# Altium project RegistrationModule.PrjPCB (part 3 of 4)

## Sheet FPGA.SchDoc
size 685 x 375 mm; PageSetup: Record=PageOptions|CenterHorizontal=True|CenterVertical=True|PrintScale=0.85|XCorrection=1.00|YCorrection=1.00|PrintKind=2|BorderSize=5000000|LeftOffset=0|BottomOffset=0|Orientation=2|PaperLength=1000|PaperWidth=1000|Scale=100|PaperSource=7|PrintQuality=-4|MediaType=1|DitherType=10|PaperKind=A2|PrintScaleMode=1
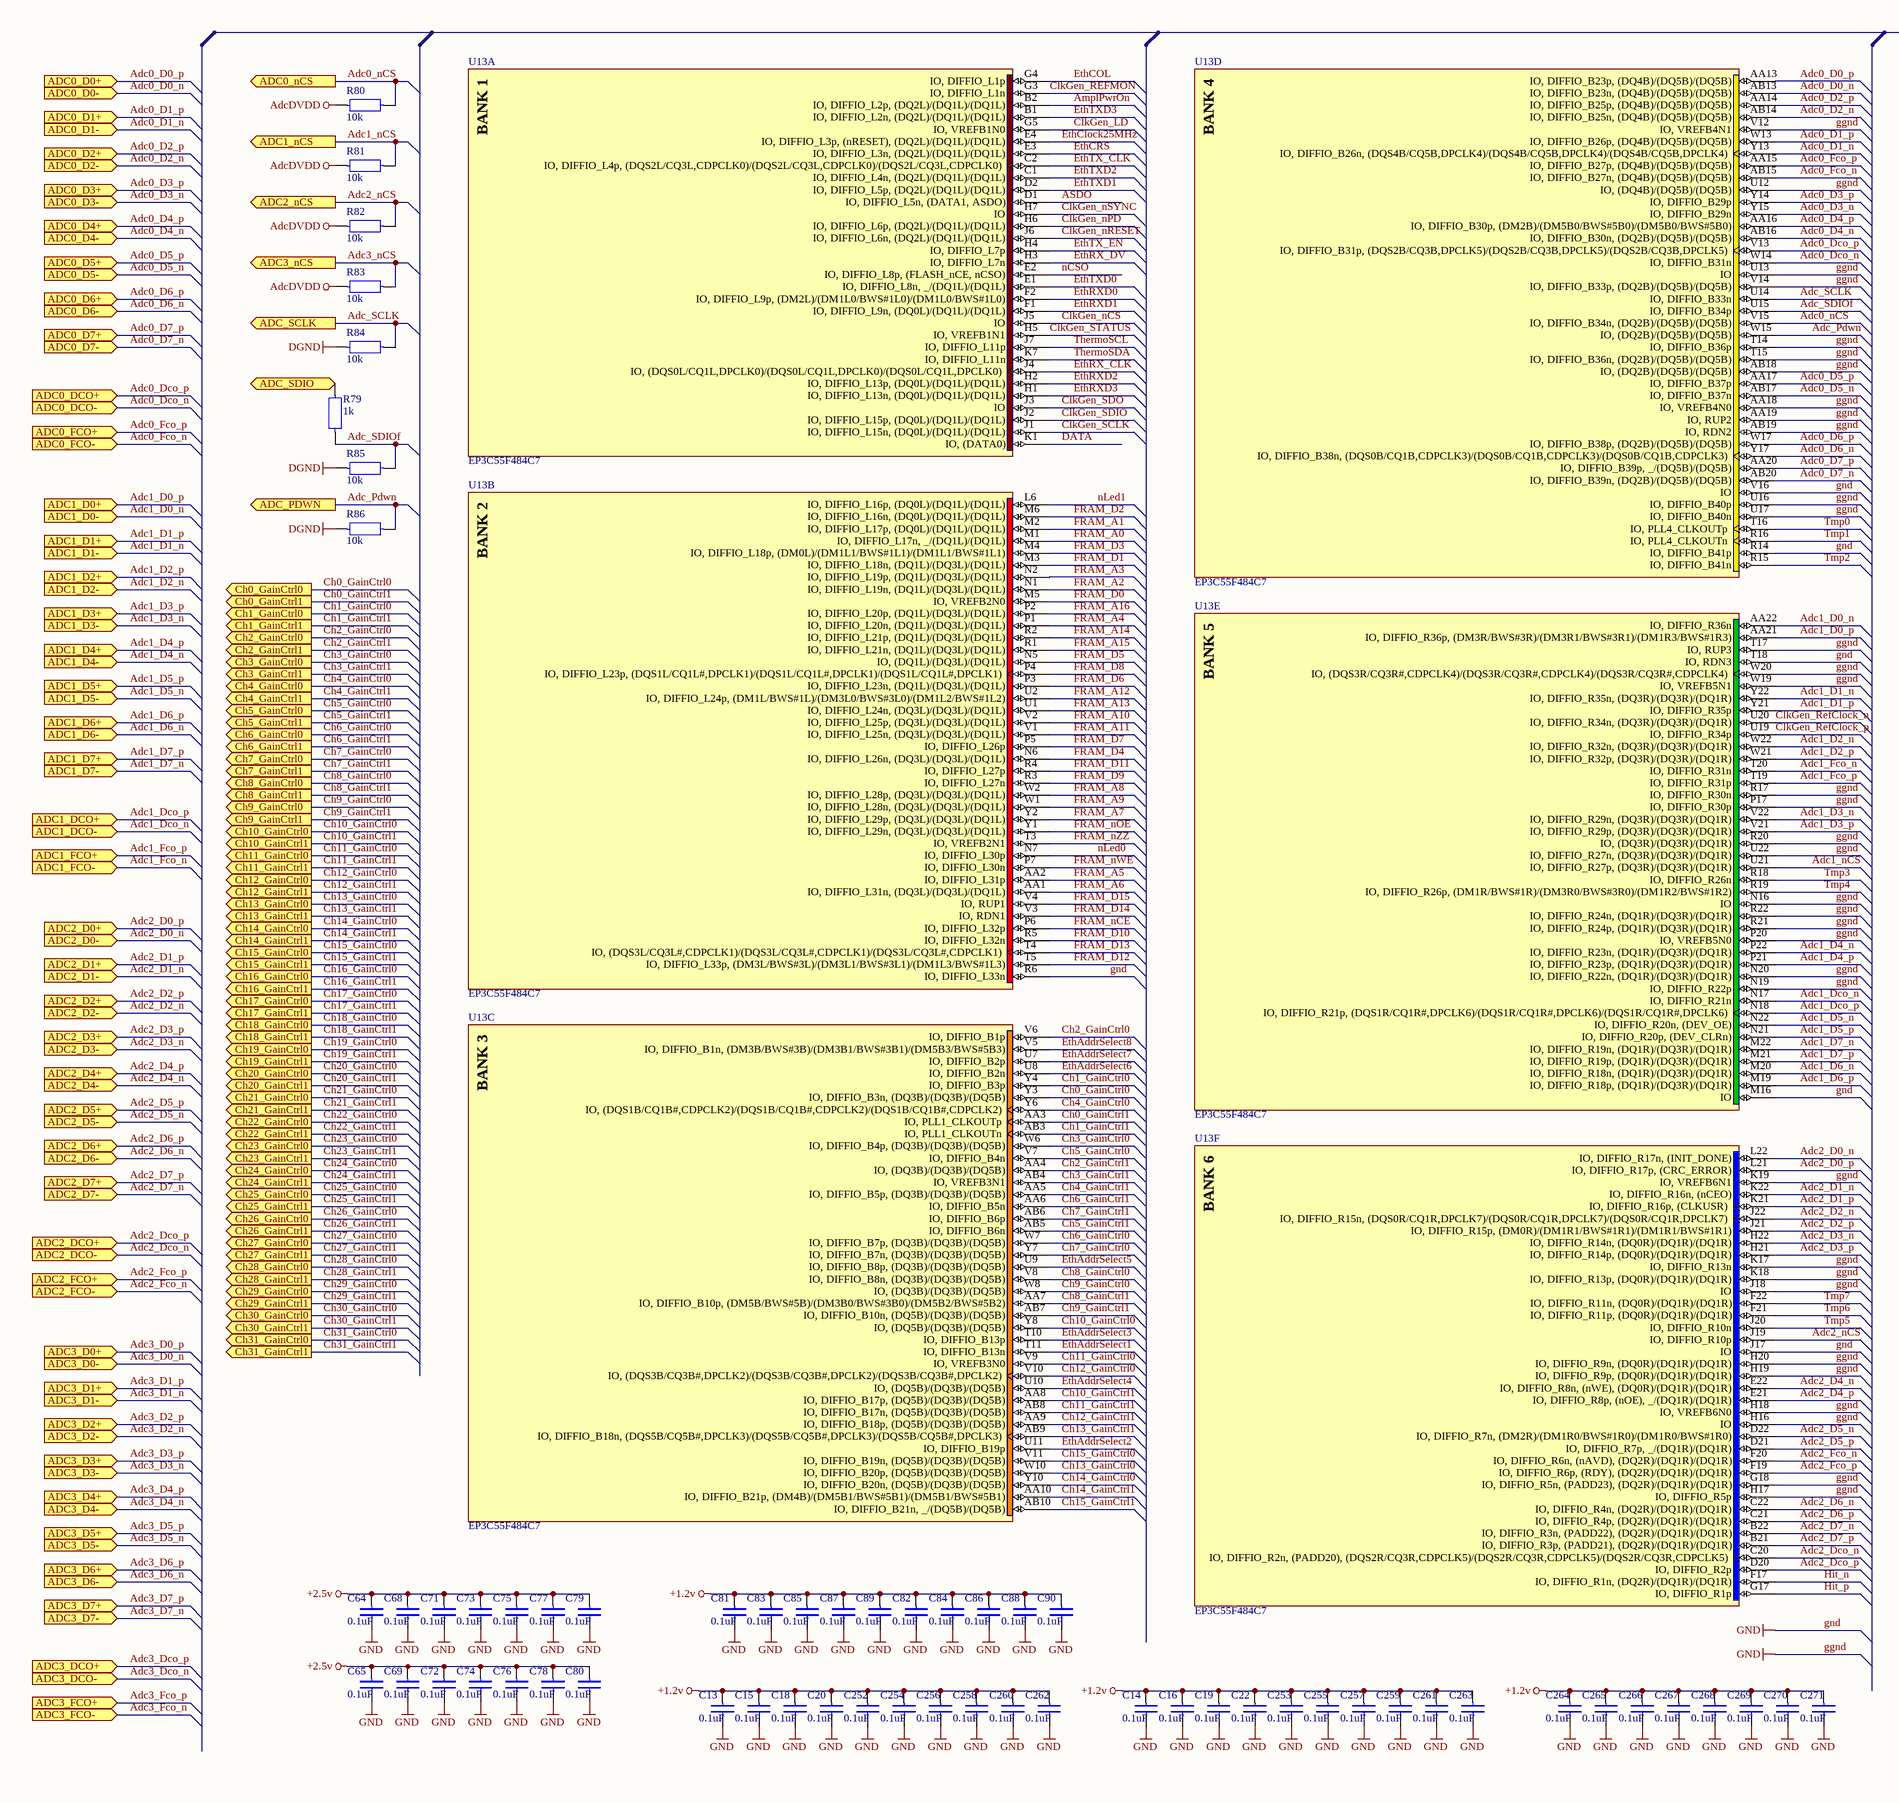
[diagram p7: FPGA.SchDoc, left]
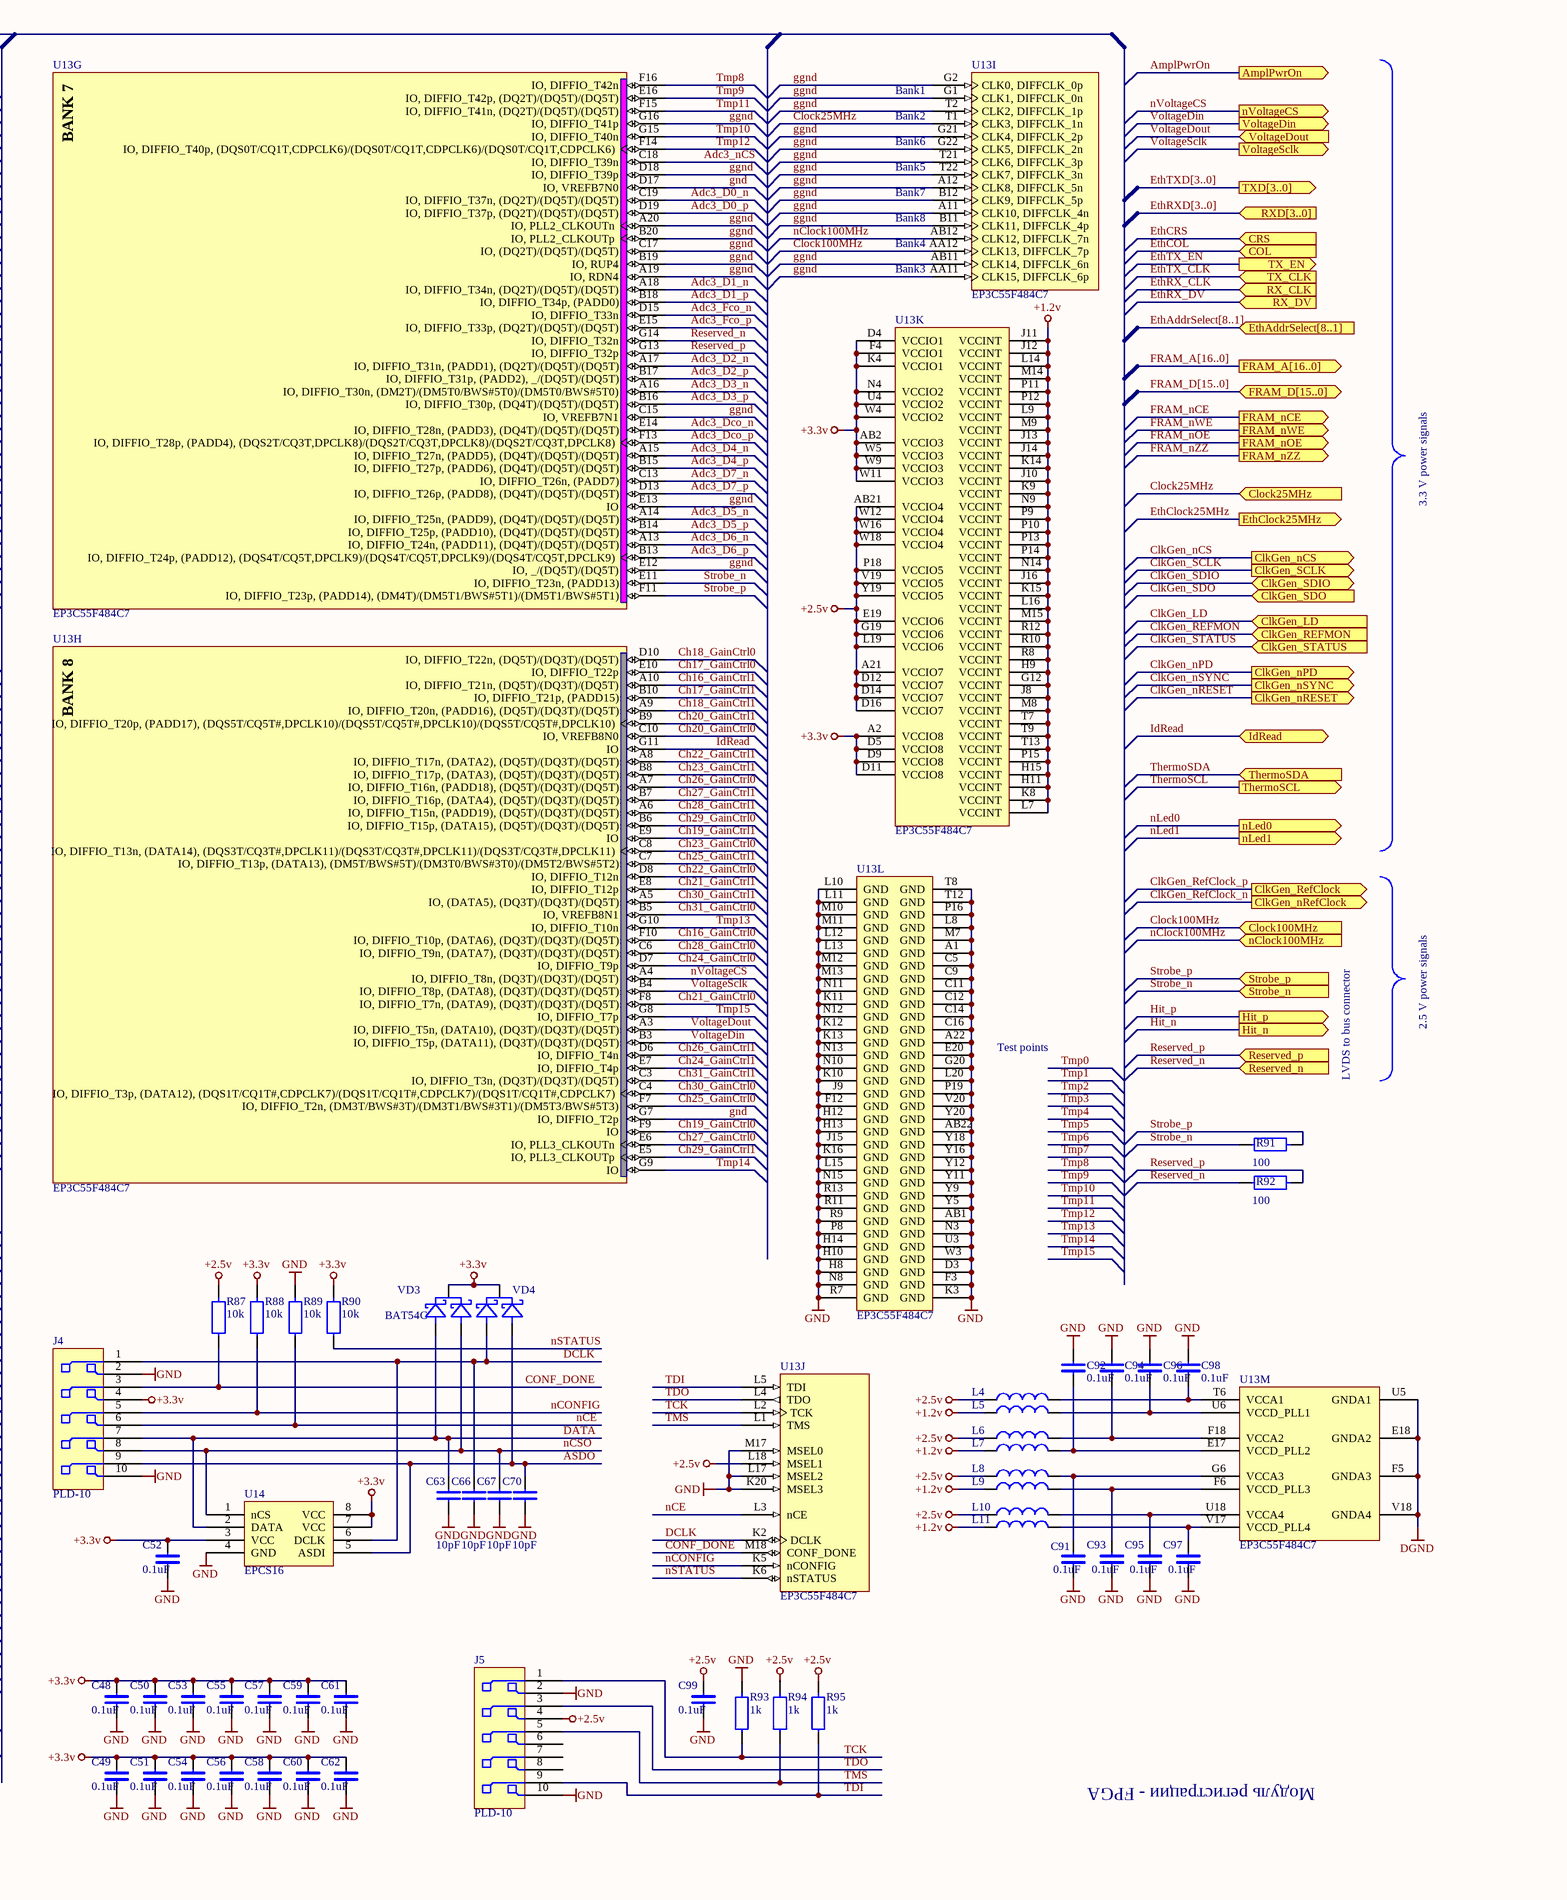
[diagram p8: FPGA.SchDoc, right]

### Parts
C13  0.1uF  [0402]
C14  0.1uF  [0402]
C15  0.1uF  [0402]
C16  0.1uF  [0402]
C18  0.1uF  [0402]
C19  0.1uF  [0402]
C20  0.1uF  [0402]
C22  0.1uF  [0402]
C48  0.1uF  [0402]
C49  0.1uF  [0402]
C50  0.1uF  [0402]
C51  0.1uF  [0402]
C52  0.1uF  [0603]
C53  0.1uF  [0402]
C54  0.1uF  [0402]
C55  0.1uF  [0402]
C56  0.1uF  [0402]
C57  0.1uF  [0402]
C58  0.1uF  [0402]
C59  0.1uF  [0402]
C60  0.1uF  [0402]
C61  0.1uF  [0402]
C62  0.1uF  [0402]
C63  10pF  [0603]
C64  0.1uF  [0402]
C65  0.1uF  [0402]
C66  10pF  [0603]
C67  10pF  [0603]
C68  0.1uF  [0402]
C69  0.1uF  [0402]
C70  10pF  [0603]
C71  0.1uF  [0402]
C72  0.1uF  [0402]
C73  0.1uF  [0402]
C74  0.1uF  [0402]
C75  0.1uF  [0402]
C76  0.1uF  [0402]
C77  0.1uF  [0402]
C78  0.1uF  [0402]
C79  0.1uF  [0402]
C80  0.1uF  [0402]
C81  0.1uF  [0402]
C82  0.1uF  [0402]
C83  0.1uF  [0402]
C84  0.1uF  [0402]
C85  0.1uF  [0402]
C86  0.1uF  [0402]
C87  0.1uF  [0402]
C88  0.1uF  [0402]
C89  0.1uF  [0402]
C90  0.1uF  [0402]
C91  0.1uF  [0402]
C92  0.1uF  [0402]
C93  0.1uF  [0402]
C94  0.1uF  [0402]
C95  0.1uF  [0402]
C96  0.1uF  [0402]
C97  0.1uF  [0402]
C98  0.1uF  [0402]
C99  0.1uF  [0603]
C252  0.1uF  [0402]
C253  0.1uF  [0402]
C254  0.1uF  [0402]
C255  0.1uF  [0402]
C256  0.1uF  [0402]
C257  0.1uF  [0402]
C258  0.1uF  [0402]
C259  0.1uF  [0402]
C260  0.1uF  [0402]
C261  0.1uF  [0402]
C262  0.1uF  [0402]
C263  0.1uF  [0402]
C264  0.1uF  [0402]
C265  0.1uF  [0402]
C266  0.1uF  [0402]
C267  0.1uF  [0402]
C268  0.1uF  [0402]
C269  0.1uF  [0402]
C270  0.1uF  [0402]
C271  0.1uF  [0402]
J4  PLD-10  [PLD10]
J5  PLD-10  [PLD10]
L4  EXC3BB221H  [0603]  (value not drawn)
L5  EXC3BB221H  [0603]  (value not drawn)
L6  EXC3BB221H  [0603]  (value not drawn)
L7  EXC3BB221H  [0603]  (value not drawn)
L8  EXC3BB221H  [0603]  (value not drawn)
L9  EXC3BB221H  [0603]  (value not drawn)
L10  EXC3BB221H  [0603]  (value not drawn)
L11  EXC3BB221H  [0603]  (value not drawn)
R79  1k  [0603]
R80  10k  [0603]
R81  10k  [0603]
R82  10k  [0603]
R83  10k  [0603]
R84  10k  [0603]
R85  10k  [0603]
R86  10k  [0603]
R87  10k  [0603]
R88  10k  [0603]
R89  10k  [0603]
R90  10k  [0603]
R91  100  [0402]
R92  100  [0402]
R93  1k  [0603]
R94  1k  [0603]
R95  1k  [0603]
U13  EP3C55F484C7  [FBGA484-3]  (parts A,B,C,D,E,F,G,H,I,J,K,L,M of 13)
U14  EPCS16  [8SOIC150]
VD3  BAT54C  [SOT-23]
VD4  BAT54C  [SOT-23]  (value not drawn)

### Ports
ADC0_D0+ (in), ADC0_D0- (in), ADC0_D1+ (in), ADC0_D1- (in), ADC0_D2+ (in), ADC0_D2- (in), ADC0_D3+ (in), ADC0_D3- (in), ADC0_D4+ (in), ADC0_D4- (in), ADC0_D5+ (in), ADC0_D5- (in), ADC0_D6+ (in), ADC0_D6- (in), ADC0_D7+ (in), ADC0_D7- (in), ADC0_DCO+ (in), ADC0_DCO- (in), ADC0_FCO+ (in), ADC0_FCO- (in), ADC0_nCS (out), ADC1_D0+ (in), ADC1_D0- (in), ADC1_D1+ (in), ADC1_D1- (in), ADC1_D2+ (in), ADC1_D2- (in), ADC1_D3+ (in), ADC1_D3- (in), ADC1_D4+ (in), ADC1_D4- (in), ADC1_D5+ (in), ADC1_D5- (in), ADC1_D6+ (in), ADC1_D6- (in), ADC1_D7+ (in), ADC1_D7- (in), ADC1_DCO+ (in), ADC1_DCO- (in), ADC1_FCO+ (in), ADC1_FCO- (in), ADC1_nCS (out), ADC2_D0+ (in), ADC2_D0- (in), ADC2_D1+ (in), ADC2_D1- (in), ADC2_D2+ (in), ADC2_D2- (in), ADC2_D3+ (in), ADC2_D3- (in), ADC2_D4+ (in), ADC2_D4- (in), ADC2_D5+ (in), ADC2_D5- (in), ADC2_D6+ (in), ADC2_D6- (in), ADC2_D7+ (in), ADC2_D7- (in), ADC2_DCO+ (in), ADC2_DCO- (in), ADC2_FCO+ (in), ADC2_FCO- (in), ADC2_nCS (out), ADC3_D0+ (in), ADC3_D0- (in), ADC3_D1+ (in), ADC3_D1- (in), ADC3_D2+ (in), ADC3_D2- (in), ADC3_D3+ (in), ADC3_D3- (in), ADC3_D4+ (in), ADC3_D4- (in), ADC3_D5+ (in), ADC3_D5- (in), ADC3_D6+ (in), ADC3_D6- (in), ADC3_D7+ (in), ADC3_D7- (in), ADC3_DCO+ (in), ADC3_DCO- (in), ADC3_FCO+ (in), ADC3_FCO- (in), ADC3_nCS (out), ADC_PDWN (out), ADC_SCLK (out), ADC_SDIO (bidir), AmplPwrOn (out), Ch0_GainCtrl0 (out), Ch0_GainCtrl1 (out), Ch1_GainCtrl0 (out), Ch1_GainCtrl1 (out), Ch2_GainCtrl0 (out), Ch2_GainCtrl1 (out), Ch3_GainCtrl0 (out), Ch3_GainCtrl1 (out), Ch4_GainCtrl0 (out), Ch4_GainCtrl1 (out), Ch5_GainCtrl0 (out), Ch5_GainCtrl1 (out), Ch6_GainCtrl0 (out), Ch6_GainCtrl1 (out), Ch7_GainCtrl0 (out), Ch7_GainCtrl1 (out), Ch8_GainCtrl0 (out), Ch8_GainCtrl1 (out), Ch9_GainCtrl0 (out), Ch9_GainCtrl1 (out), Ch10_GainCtrl0 (out), Ch10_GainCtrl1 (out), Ch11_GainCtrl0 (out), Ch11_GainCtrl1 (out), Ch12_GainCtrl0 (out), Ch12_GainCtrl1 (out), Ch13_GainCtrl0 (out), Ch13_GainCtrl1 (out), Ch14_GainCtrl0 (out), Ch14_GainCtrl1 (out), Ch15_GainCtrl0 (out), Ch15_GainCtrl1 (out), Ch16_GainCtrl0 (out), Ch16_GainCtrl1 (out), Ch17_GainCtrl0 (out), Ch17_GainCtrl1 (out), Ch18_GainCtrl0 (out), Ch18_GainCtrl1 (out), Ch19_GainCtrl0 (out), Ch19_GainCtrl1 (out), Ch20_GainCtrl0 (out), Ch20_GainCtrl1 (out), Ch21_GainCtrl0 (out), Ch21_GainCtrl1 (out), Ch22_GainCtrl0 (out), Ch22_GainCtrl1 (out), Ch23_GainCtrl0 (out), Ch23_GainCtrl1 (out), Ch24_GainCtrl0 (out), Ch24_GainCtrl1 (out), Ch25_GainCtrl0 (out), Ch25_GainCtrl1 (out), Ch26_GainCtrl0 (out), Ch26_GainCtrl1 (out), Ch27_GainCtrl0 (out), Ch27_GainCtrl1 (out), Ch28_GainCtrl0 (out), Ch28_GainCtrl1 (out), Ch29_GainCtrl0 (out), Ch29_GainCtrl1 (out), Ch30_GainCtrl0 (out), Ch30_GainCtrl1 (out), Ch31_GainCtrl0 (out), Ch31_GainCtrl1 (out), ClkGen_LD (in), ClkGen_nCS (out), ClkGen_nPD (out), ClkGen_nRefClock (out), ClkGen_nRESET (out), ClkGen_nSYNC (out), ClkGen_RefClock (out), ClkGen_REFMON (in), ClkGen_SCLK (out), ClkGen_SDIO (bidir), ClkGen_SDO (in), ClkGen_STATUS (in), Clock25MHz (in), Clock100MHz (in), COL (in), CRS (in), EthAddrSelect[8..1] (in), EthClock25MHz (out), FRAM_A[16..0] (out), FRAM_D[15..0] (bidir), FRAM_nCE (out), FRAM_nOE (out), FRAM_nWE (out), FRAM_nZZ (out), Hit_n (out), Hit_p (out), IdRead (bidir), nClock100MHz (in), nLed0 (out), nLed1 (out), nVoltageCS (out), Reserved_n (in), Reserved_p (in), RX_CLK (in), RX_DV (in), RXD[3..0] (in), Strobe_n (in), Strobe_p (in), ThermoSCL (out), ThermoSDA (in), TX_CLK (in), TX_EN (out), TXD[3..0] (out), VoltageDin (out), VoltageDout (in), VoltageSclk (out)

### Nets
+1.2v: C13.2 C14.2 C15.2 C16.2 C18.2 C19.2 C20.2 C22.2 C81.2 C82.2 C83.2 C84.2 C85.2 C86.2 C87.2 C88.2 C89.2 C90.2 C252.2 C253.2 C254.2 C255.2 C256.2 C257.2 C258.2 C259.2 C260.2 C261.2 C262.2 C263.2 C264.2 C265.2 C266.2 C267.2 C268.2 C269.2 C270.2 C271.2 L5.1 L7.1 L9.1 L11.1 U13.G12(VCCINT) U13.H9(VCCINT) U13.H11(VCCINT) U13.H15(VCCINT) U13.J8(VCCINT) U13.J10(VCCINT) U13.J11(VCCINT) U13.J12(VCCINT) U13.J13(VCCINT) U13.J14(VCCINT) U13.J16(VCCINT) U13.K8(VCCINT) U13.K9(VCCINT) U13.K14(VCCINT) U13.K15(VCCINT) U13.L7(VCCINT) U13.L9(VCCINT) U13.L14(VCCINT) U13.L16(VCCINT) U13.M8(VCCINT) U13.M9(VCCINT) U13.M14(VCCINT) U13.M15(VCCINT) U13.N9(VCCINT) U13.N14(VCCINT) U13.P9(VCCINT) U13.P10(VCCINT) U13.P11(VCCINT) U13.P12(VCCINT) U13.P13(VCCINT) U13.P14(VCCINT) U13.P15(VCCINT) U13.R8(VCCINT) U13.R10(VCCINT) U13.R12(VCCINT) U13.T7(VCCINT) U13.T9(VCCINT) U13.T13(VCCINT)
+2.5v: C64.2 C65.2 C68.2 C69.2 C71.2 C72.2 C73.2 C74.2 C75.2 C76.2 C77.2 C78.2 C79.2 C80.2 C99.2 J5.4 L4.1 L6.1 L8.1 L10.1 R87.2 R94.2 R95.2 U13.A21(VCCIO7) U13.AB21(VCCIO4) U13.D12(VCCIO7) U13.D14(VCCIO7) U13.D16(VCCIO7) U13.E19(VCCIO6) U13.G19(VCCIO6) U13.L18(MSEL1) U13.L19(VCCIO6) U13.P18(VCCIO5) U13.V19(VCCIO5) U13.W12(VCCIO4) U13.W16(VCCIO4) U13.W18(VCCIO4) U13.Y19(VCCIO5)
+3.3v: C48.2 C49.2 C50.2 C51.2 C52.2 C53.2 C54.2 C55.2 C56.2 C57.2 C58.2 C59.2 C60.2 C61.2 C62.2 J4.4 R88.2 R90.2 U13.A2(VCCIO8) U13.AB2(VCCIO3) U13.D4(VCCIO1) U13.D5(VCCIO8) U13.D9(VCCIO8) U13.D11(VCCIO8) U13.F4(VCCIO1) U13.K4(VCCIO1) U13.N4(VCCIO2) U13.U4(VCCIO2) U13.W4(VCCIO2) U13.W5(VCCIO3) U13.W9(VCCIO3) U13.W11(VCCIO3) U14.3(VCC) U14.7(VCC) U14.8(VCC) VD3.3 VD4.3
AdcDVDD: R80.1 R81.1 R82.1 R83.1
DGND: C13.1 C14.1 C15.1 C16.1 C18.1 C19.1 C20.1 C22.1 C48.1 C49.1 C50.1 C51.1 C52.1 C53.1 C54.1 C55.1 C56.1 C57.1 C58.1 C59.1 C60.1 C61.1 C62.1 C63.1 C64.1 C65.1 C66.1 C67.1 C68.1 C69.1 C70.1 C71.1 C72.1 C73.1 C74.1 C75.1 C76.1 C77.1 C78.1 C79.1 C80.1 C81.1 C82.1 C83.1 C84.1 C85.1 C86.1 C87.1 C88.1 C89.1 C90.1 C91.1 C92.1 C93.1 C94.1 C95.1 C96.1 C97.1 C98.1 C99.1 C252.1 C253.1 C254.1 C255.1 C256.1 C257.1 C258.1 C259.1 C260.1 C261.1 C262.1 C263.1 C264.1 C265.1 C266.1 C267.1 C268.1 C269.1 C270.1 C271.1 J4.2 J4.10 J5.2 J5.10 R84.1 R85.1 R86.1 R89.2 R93.2 U13.A1(GND) U13.A11(CLK10,_DIFFCLK_4n) U13.A12(CLK8,_DIFFCLK_5n) U13.A19(IO,_RDN4) U13.A20(IO,_PLL2_CLKOUTn) U13.A22(GND) U13.AA11(CLK15,_DIFFCLK_6p) U13.AA18(IO,_VREFB4N0) U13.AA19(IO,_RUP2) U13.AB1(GND) U13.AB11(CLK14,_DIFFCLK_6n) U13.AB18(IO,_(DQ2B)/(DQ5B)/(DQ5B)) U13.AB19(IO,_RDN2) U13.AB22(GND) U13.B11(CLK11,_DIFFCLK_4p) U13.B12(CLK9,_DIFFCLK_5p) U13.B19(IO,_RUP4) U13.B20(IO,_PLL2_CLKOUTp) U13.C5(GND) U13.C9(GND) U13.C11(GND) U13.C12(GND) U13.C14(GND) U13.C15(IO,_VREFB7N1) U13.C16(GND) U13.C17(IO,_(DQ2T)/(DQ5T)/(DQ5T)) U13.D3(GND) U13.D17(IO,_VREFB7N0) U13.D18(IO,_DIFFIO_T39p) U13.E12(IO,__/(DQ5T)/(DQ5T)) U13.E13(IO) U13.E18(GNDA2) U13.E20(GND) U13.F3(GND) U13.F5(GNDA3) U13.F12(GND) U13.G1(CLK1,_DIFFCLK_0n) U13.G2(CLK0,_DIFFCLK_0p) U13.G7(IO,_DIFFIO_T2p) U13.G16(IO,_DIFFIO_T41p) U13.G18(IO,_DIFFIO_R5n,_(PADD23),_(DQ2R)/(DQ1R)/(DQ1R)) U13.G20(GND) U13.G21(CLK4,_DIFFCLK_2p) U13.G22(CLK5,_DIFFCLK_2n) U13.H8(GND) U13.H10(GND) U13.H12(GND) U13.H13(GND) U13.H14(GND) U13.H16(IO) U13.H17(IO,_DIFFIO_R5p) U13.H18(IO,_VREFB6N0) U13.H19(IO,_DIFFIO_R9p,_(DQ0R)/(DQ1R)/(DQ1R)) U13.H20(IO,_DIFFIO_R9n,_(DQ0R)/(DQ1R)/(DQ1R)) U13.J9(GND) U13.J15(GND) U13.J17(IO) U13.J18(IO) U13.K3(GND) U13.K10(GND) U13.K11(GND) U13.K12(GND) U13.K13(GND) U13.K16(GND) U13.K17(IO,_DIFFIO_R13n) U13.K18(IO,_DIFFIO_R13p,_(DQ0R)/(DQ1R)/(DQ1R)) U13.K19(IO,_VREFB6N1) U13.K20(MSEL3) U13.L8(GND) U13.L10(GND) U13.L11(GND) U13.L12(GND) U13.L13(GND) U13.L15(GND) U13.L17(MSEL2) U13.L20(GND) U13.M7(GND) U13.M10(GND) U13.M11(GND) U13.M12(GND) U13.M13(GND) U13.M16(IO) U13.M17(MSEL0) U13.N3(GND) U13.N8(GND) U13.N10(GND) U13.N11(GND) U13.N12(GND) U13.N13(GND) U13.N15(GND) U13.N16(IO) U13.N19(IO,_DIFFIO_R22p) U13.N20(IO,_DIFFIO_R22n,_(DQ1R)/(DQ3R)/(DQ1R)) U13.P8(GND) U13.P16(GND) U13.P17(IO,_DIFFIO_R30p) U13.P19(GND) U13.P20(IO,_VREFB5N0) U13.R6(IO,_DIFFIO_L33n) U13.R7(GND) U13.R9(GND) U13.R11(GND) U13.R13(GND) U13.R14(IO,_DIFFIO_B41p) U13.R17(IO,_DIFFIO_R30n) U13.R20(IO,_(DQ3R)/(DQ3R)/(DQ1R)) U13.R21(IO,_DIFFIO_R24p,_(DQ1R)/(DQ3R)/(DQ1R)) U13.R22(IO,_DIFFIO_R24n,_(DQ1R)/(DQ3R)/(DQ1R)) U13.T2(CLK2,_DIFFCLK_1p) U13.T8(GND) U13.T12(GND) U13.T14(IO,_DIFFIO_B36p) U13.T15(IO,_DIFFIO_B36n,_(DQ2B)/(DQ5B)/(DQ5B)) U13.T17(IO,_RUP3) U13.T18(IO,_RDN3) U13.T21(CLK6,_DIFFCLK_3p) U13.T22(CLK7,_DIFFCLK_3n) U13.U3(GND) U13.U5(GNDA1) U13.U12(IO,_(DQ4B)/(DQ5B)/(DQ5B)) U13.U13(IO) U13.U16(IO,_DIFFIO_B40p) U13.U17(IO,_DIFFIO_B40n) U13.U22(IO,_DIFFIO_R27n,_(DQ3R)/(DQ3R)/(DQ1R)) U13.V12(IO,_VREFB4N1) U13.V14(IO,_DIFFIO_B33p,_(DQ2B)/(DQ5B)/(DQ5B)) U13.V16(IO) U13.V18(GNDA4) U13.V20(GND) U13.W3(GND) U13.W19(IO,_VREFB5N1) U13.W20(IO,_(DQS3R/CQ3R#,CDPCLK4)/(DQS3R/CQ3R#,CDPCLK4)/(DQS3R/CQ3R#,CDPCLK4)) U13.Y5(GND) U13.Y9(GND) U13.Y11(GND) U13.Y12(GND) U13.Y16(GND) U13.Y18(GND) U13.Y20(GND) U14.4(GND)  [also labelled ggnd, GND]  [project net C_L1-PhD1]
Adc0_D0_n: U13.AB13(IO,_DIFFIO_B23n,_(DQ4B)/(DQ5B)/(DQ5B)) ; port ADC0_D0-
Adc0_D0_p: U13.AA13(IO,_DIFFIO_B23p,_(DQ4B)/(DQ5B)/(DQ5B)) ; port ADC0_D0+
Adc0_D1_n: U13.Y13(IO,_DIFFIO_B26n,_(DQS4B/CQ5B,DPCLK4)/(DQS4B/CQ5B,DPCLK4)/(DQS4B/CQ5B,DPCLK4)) ; port ADC0_D1-
Adc0_D1_p: U13.W13(IO,_DIFFIO_B26p,_(DQ4B)/(DQ5B)/(DQ5B)) ; port ADC0_D1+
Adc0_D2_n: U13.AB14(IO,_DIFFIO_B25n,_(DQ4B)/(DQ5B)/(DQ5B)) ; port ADC0_D2-
Adc0_D2_p: U13.AA14(IO,_DIFFIO_B25p,_(DQ4B)/(DQ5B)/(DQ5B)) ; port ADC0_D2+
Adc0_D3_n: U13.Y15(IO,_DIFFIO_B29n) ; port ADC0_D3-
Adc0_D3_p: U13.Y14(IO,_DIFFIO_B29p) ; port ADC0_D3+
Adc0_D4_n: U13.AB16(IO,_DIFFIO_B30n,_(DQ2B)/(DQ5B)/(DQ5B)) ; port ADC0_D4-
Adc0_D4_p: U13.AA16(IO,_DIFFIO_B30p,_(DM2B)/(DM5B0/BWS#5B0)/(DM5B0/BWS#5B0)) ; port ADC0_D4+
Adc0_D5_n: U13.AB17(IO,_DIFFIO_B37n) ; port ADC0_D5-
Adc0_D5_p: U13.AA17(IO,_DIFFIO_B37p) ; port ADC0_D5+
Adc0_D6_n: U13.Y17(IO,_DIFFIO_B38n,_(DQS0B/CQ1B,CDPCLK3)/(DQS0B/CQ1B,CDPCLK3)/(DQS0B/CQ1B,CDPCLK3)) ; port ADC0_D6-
Adc0_D6_p: U13.W17(IO,_DIFFIO_B38p,_(DQ2B)/(DQ5B)/(DQ5B)) ; port ADC0_D6+
Adc0_D7_n: U13.AB20(IO,_DIFFIO_B39n,_(DQ2B)/(DQ5B)/(DQ5B)) ; port ADC0_D7-
Adc0_D7_p: U13.AA20(IO,_DIFFIO_B39p,__/(DQ5B)/(DQ5B)) ; port ADC0_D7+
Adc0_Dco_n: U13.W14(IO,_DIFFIO_B31n) ; port ADC0_DCO-
Adc0_Dco_p: U13.V13(IO,_DIFFIO_B31p,_(DQS2B/CQ3B,DPCLK5)/(DQS2B/CQ3B,DPCLK5)/(DQS2B/CQ3B,DPCLK5)) ; port ADC0_DCO+
Adc0_Fco_n: U13.AB15(IO,_DIFFIO_B27n,_(DQ4B)/(DQ5B)/(DQ5B)) ; port ADC0_FCO-
Adc0_Fco_p: U13.AA15(IO,_DIFFIO_B27p,_(DQ4B)/(DQ5B)/(DQ5B)) ; port ADC0_FCO+
Adc0_nCS: R80.2 U13.V15(IO,_DIFFIO_B34n,_(DQ2B)/(DQ5B)/(DQ5B)) ; port ADC0_nCS
Adc1_D0_n: U13.AA22(IO,_DIFFIO_R36n) ; port ADC1_D0-
Adc1_D0_p: U13.AA21(IO,_DIFFIO_R36p,_(DM3R/BWS#3R)/(DM3R1/BWS#3R1)/(DM1R3/BWS#1R3)) ; port ADC1_D0+
Adc1_D1_n: U13.Y22(IO,_DIFFIO_R35n,_(DQ3R)/(DQ3R)/(DQ1R)) ; port ADC1_D1-
Adc1_D1_p: U13.Y21(IO,_DIFFIO_R35p) ; port ADC1_D1+
Adc1_D2_n: U13.W22(IO,_DIFFIO_R32n,_(DQ3R)/(DQ3R)/(DQ1R)) ; port ADC1_D2-
Adc1_D2_p: U13.W21(IO,_DIFFIO_R32p,_(DQ3R)/(DQ3R)/(DQ1R)) ; port ADC1_D2+
Adc1_D3_n: U13.V22(IO,_DIFFIO_R29n,_(DQ3R)/(DQ3R)/(DQ1R)) ; port ADC1_D3-
Adc1_D3_p: U13.V21(IO,_DIFFIO_R29p,_(DQ3R)/(DQ3R)/(DQ1R)) ; port ADC1_D3+
Adc1_D4_n: U13.P22(IO,_DIFFIO_R23n,_(DQ1R)/(DQ3R)/(DQ1R)) ; port ADC1_D4-
Adc1_D4_p: U13.P21(IO,_DIFFIO_R23p,_(DQ1R)/(DQ3R)/(DQ1R)) ; port ADC1_D4+
Adc1_D5_n: U13.N22(IO,_DIFFIO_R20n,_(DEV_OE)) ; port ADC1_D5-
Adc1_D5_p: U13.N21(IO,_DIFFIO_R20p,_(DEV_CLRn)) ; port ADC1_D5+
Adc1_D6_n: U13.M20(IO,_DIFFIO_R18n,_(DQ1R)/(DQ3R)/(DQ1R)) ; port ADC1_D6-
Adc1_D6_p: U13.M19(IO,_DIFFIO_R18p,_(DQ1R)/(DQ3R)/(DQ1R)) ; port ADC1_D6+
Adc1_D7_n: U13.M22(IO,_DIFFIO_R19n,_(DQ1R)/(DQ3R)/(DQ1R)) ; port ADC1_D7-
Adc1_D7_p: U13.M21(IO,_DIFFIO_R19p,_(DQ1R)/(DQ3R)/(DQ1R)) ; port ADC1_D7+
Adc1_Dco_n: U13.N17(IO,_DIFFIO_R21n) ; port ADC1_DCO-
Adc1_Dco_p: U13.N18(IO,_DIFFIO_R21p,_(DQS1R/CQ1R#,DPCLK6)/(DQS1R/CQ1R#,DPCLK6)/(DQS1R/CQ1R#,DPCLK6)) ; port ADC1_DCO+
Adc1_Fco_n: U13.T20(IO,_DIFFIO_R31n) ; port ADC1_FCO-
Adc1_Fco_p: U13.T19(IO,_DIFFIO_R31p) ; port ADC1_FCO+
Adc1_nCS: R81.2 U13.U21(IO,_DIFFIO_R27p,_(DQ3R)/(DQ3R)/(DQ1R)) ; port ADC1_nCS
Adc2_D0_n: U13.L22(IO,_DIFFIO_R17n,_(INIT_DONE)) ; port ADC2_D0-
Adc2_D0_p: U13.L21(IO,_DIFFIO_R17p,_(CRC_ERROR)) ; port ADC2_D0+
Adc2_D1_n: U13.K22(IO,_DIFFIO_R16n,_(nCEO)) ; port ADC2_D1-
Adc2_D1_p: U13.K21(IO,_DIFFIO_R16p,_(CLKUSR)) ; port ADC2_D1+
Adc2_D2_n: U13.J22(IO,_DIFFIO_R15n,_(DQS0R/CQ1R,DPCLK7)/(DQS0R/CQ1R,DPCLK7)/(DQS0R/CQ1R,DPCLK7)) ; port ADC2_D2-
Adc2_D2_p: U13.J21(IO,_DIFFIO_R15p,_(DM0R)/(DM1R1/BWS#1R1)/(DM1R1/BWS#1R1)) ; port ADC2_D2+
Adc2_D3_n: U13.H22(IO,_DIFFIO_R14n,_(DQ0R)/(DQ1R)/(DQ1R)) ; port ADC2_D3-
Adc2_D3_p: U13.H21(IO,_DIFFIO_R14p,_(DQ0R)/(DQ1R)/(DQ1R)) ; port ADC2_D3+
Adc2_D4_n: U13.E22(IO,_DIFFIO_R8n,_(nWE),_(DQ0R)/(DQ1R)/(DQ1R)) ; port ADC2_D4-
Adc2_D4_p: U13.E21(IO,_DIFFIO_R8p,_(nOE),__/(DQ1R)/(DQ1R)) ; port ADC2_D4+
Adc2_D5_n: U13.D22(IO,_DIFFIO_R7n,_(DM2R)/(DM1R0/BWS#1R0)/(DM1R0/BWS#1R0)) ; port ADC2_D5-
Adc2_D5_p: U13.D21(IO,_DIFFIO_R7p,__/(DQ1R)/(DQ1R)) ; port ADC2_D5+
Adc2_D6_n: U13.C22(IO,_DIFFIO_R4n,_(DQ2R)/(DQ1R)/(DQ1R)) ; port ADC2_D6-
Adc2_D6_p: U13.C21(IO,_DIFFIO_R4p,_(DQ2R)/(DQ1R)/(DQ1R)) ; port ADC2_D6+
Adc2_D7_n: U13.B22(IO,_DIFFIO_R3n,_(PADD22),_(DQ2R)/(DQ1R)/(DQ1R)) ; port ADC2_D7-
Adc2_D7_p: U13.B21(IO,_DIFFIO_R3p,_(PADD21),_(DQ2R)/(DQ1R)/(DQ1R)) ; port ADC2_D7+
Adc2_Dco_n: U13.C20(IO,_DIFFIO_R2n,_(PADD20),_(DQS2R/CQ3R,CDPCLK5)/(DQS2R/CQ3R,CDPCLK5)/(DQS2R/CQ3R,CDPCLK5)) ; port ADC2_DCO-
Adc2_Dco_p: U13.D20(IO,_DIFFIO_R2p) ; port ADC2_DCO+
Adc2_Fco_n: U13.F20(IO,_DIFFIO_R6n,_(nAVD),_(DQ2R)/(DQ1R)/(DQ1R)) ; port ADC2_FCO-
Adc2_Fco_p: U13.F19(IO,_DIFFIO_R6p,_(RDY),_(DQ2R)/(DQ1R)/(DQ1R)) ; port ADC2_FCO+
Adc2_nCS: R82.2 U13.J19(IO,_DIFFIO_R10p) ; port ADC2_nCS
Adc3_D0_n: U13.C19(IO,_DIFFIO_T37n,_(DQ2T)/(DQ5T)/(DQ5T)) ; port ADC3_D0-
Adc3_D0_p: U13.D19(IO,_DIFFIO_T37p,_(DQ2T)/(DQ5T)/(DQ5T)) ; port ADC3_D0+
Adc3_D1_n: U13.A18(IO,_DIFFIO_T34n,_(DQ2T)/(DQ5T)/(DQ5T)) ; port ADC3_D1-
Adc3_D1_p: U13.B18(IO,_DIFFIO_T34p,_(PADD0)) ; port ADC3_D1+
Adc3_D2_n: U13.A17(IO,_DIFFIO_T31n,_(PADD1),_(DQ2T)/(DQ5T)/(DQ5T)) ; port ADC3_D2-
Adc3_D2_p: U13.B17(IO,_DIFFIO_T31p,_(PADD2),__/(DQ5T)/(DQ5T)) ; port ADC3_D2+
Adc3_D3_n: U13.A16(IO,_DIFFIO_T30n,_(DM2T)/(DM5T0/BWS#5T0)/(DM5T0/BWS#5T0)) ; port ADC3_D3-
Adc3_D3_p: U13.B16(IO,_DIFFIO_T30p,_(DQ4T)/(DQ5T)/(DQ5T)) ; port ADC3_D3+
Adc3_D4_n: U13.A15(IO,_DIFFIO_T27n,_(PADD5),_(DQ4T)/(DQ5T)/(DQ5T)) ; port ADC3_D4-
Adc3_D4_p: U13.B15(IO,_DIFFIO_T27p,_(PADD6),_(DQ4T)/(DQ5T)/(DQ5T)) ; port ADC3_D4+
Adc3_D5_n: U13.A14(IO,_DIFFIO_T25n,_(PADD9),_(DQ4T)/(DQ5T)/(DQ5T)) ; port ADC3_D5-
Adc3_D5_p: U13.B14(IO,_DIFFIO_T25p,_(PADD10),_(DQ4T)/(DQ5T)/(DQ5T)) ; port ADC3_D5+
Adc3_D6_n: U13.A13(IO,_DIFFIO_T24n,_(PADD11),_(DQ4T)/(DQ5T)/(DQ5T)) ; port ADC3_D6-
Adc3_D6_p: U13.B13(IO,_DIFFIO_T24p,_(PADD12),_(DQS4T/CQ5T,DPCLK9)/(DQS4T/CQ5T,DPCLK9)/(DQS4T/CQ5T,DPCLK9)) ; port ADC3_D6+
Adc3_D7_n: U13.C13(IO,_DIFFIO_T26n,_(PADD7)) ; port ADC3_D7-
Adc3_D7_p: U13.D13(IO,_DIFFIO_T26p,_(PADD8),_(DQ4T)/(DQ5T)/(DQ5T)) ; port ADC3_D7+
Adc3_Dco_n: U13.E14(IO,_DIFFIO_T28n,_(PADD3),_(DQ4T)/(DQ5T)/(DQ5T)) ; port ADC3_DCO-
Adc3_Dco_p: U13.F13(IO,_DIFFIO_T28p,_(PADD4),_(DQS2T/CQ3T,DPCLK8)/(DQS2T/CQ3T,DPCLK8)/(DQS2T/CQ3T,DPCLK8)) ; port ADC3_DCO+
Adc3_Fco_n: U13.D15(IO,_DIFFIO_T33n) ; port ADC3_FCO-
Adc3_Fco_p: U13.E15(IO,_DIFFIO_T33p,_(DQ2T)/(DQ5T)/(DQ5T)) ; port ADC3_FCO+
Adc3_nCS: R83.2 U13.C18(IO,_DIFFIO_T39n) ; port ADC3_nCS
Adc_Pdwn: R86.2 U13.W15(IO,_(DQ2B)/(DQ5B)/(DQ5B)) ; port ADC_PDWN
Adc_Sclk: R84.2 U13.U14(IO,_DIFFIO_B33n) ; port ADC_SCLK
Adc_Sdio: R79.1 ; port ADC_SDIO
Adc_SDIOf: R79.2 R85.2 U13.U15(IO,_DIFFIO_B34p)
AmplPwrOn: U13.B2(IO,_DIFFIO_L2p,_(DQ2L)/(DQ1L)/(DQ1L)) ; port AmplPwrOn
ASDO: C70.2 J4.9 U13.D1(IO,_DIFFIO_L5n,_(DATA1,_ASDO)) U14.5(ASDI) VD4.2
Ch0_GainCtrl0: U13.Y3(IO,_DIFFIO_B3n,_(DQ3B)/(DQ3B)/(DQ5B)) ; port Ch0_GainCtrl0
Ch0_GainCtrl1: U13.AA3(IO,_PLL1_CLKOUTp) ; port Ch0_GainCtrl1
Ch1_GainCtrl0: U13.Y4(IO,_DIFFIO_B3p) ; port Ch1_GainCtrl0
Ch1_GainCtrl1: U13.AB3(IO,_PLL1_CLKOUTn) ; port Ch1_GainCtrl1
Ch2_GainCtrl0: U13.V6(IO,_DIFFIO_B1p) ; port Ch2_GainCtrl0
Ch2_GainCtrl1: U13.AA4(IO,_(DQ3B)/(DQ3B)/(DQ5B)) ; port Ch2_GainCtrl1
Ch3_GainCtrl0: U13.W6(IO,_DIFFIO_B4p,_(DQ3B)/(DQ3B)/(DQ5B)) ; port Ch3_GainCtrl0
Ch3_GainCtrl1: U13.AB4(IO,_VREFB3N1) ; port Ch3_GainCtrl1
Ch4_GainCtrl0: U13.Y6(IO,_(DQS1B/CQ1B#,CDPCLK2)/(DQS1B/CQ1B#,CDPCLK2)/(DQS1B/CQ1B#,CDPCLK2)) ; port Ch4_GainCtrl0
Ch4_GainCtrl1: U13.AA5(IO,_DIFFIO_B5p,_(DQ3B)/(DQ3B)/(DQ5B)) ; port Ch4_GainCtrl1
Ch5_GainCtrl0: U13.V7(IO,_DIFFIO_B4n) ; port Ch5_GainCtrl0
Ch5_GainCtrl1: U13.AB5(IO,_DIFFIO_B6n) ; port Ch5_GainCtrl1
Ch6_GainCtrl0: U13.W7(IO,_DIFFIO_B7p,_(DQ3B)/(DQ3B)/(DQ5B)) ; port Ch6_GainCtrl0
Ch6_GainCtrl1: U13.AA6(IO,_DIFFIO_B5n) ; port Ch6_GainCtrl1
Ch7_GainCtrl0: U13.Y7(IO,_DIFFIO_B7n,_(DQ3B)/(DQ3B)/(DQ5B)) ; port Ch7_GainCtrl0
Ch7_GainCtrl1: U13.AB6(IO,_DIFFIO_B6p) ; port Ch7_GainCtrl1
Ch8_GainCtrl0: U13.V8(IO,_DIFFIO_B8n,_(DQ3B)/(DQ3B)/(DQ5B)) ; port Ch8_GainCtrl0
Ch8_GainCtrl1: U13.AA7(IO,_DIFFIO_B10p,_(DM5B/BWS#5B)/(DM3B0/BWS#3B0)/(DM5B2/BWS#5B2)) ; port Ch8_GainCtrl1
Ch9_GainCtrl0: U13.W8(IO,_(DQ3B)/(DQ3B)/(DQ5B)) ; port Ch9_GainCtrl0
Ch9_GainCtrl1: U13.AB7(IO,_DIFFIO_B10n,_(DQ5B)/(DQ3B)/(DQ5B)) ; port Ch9_GainCtrl1
Ch10_GainCtrl0: U13.Y8(IO,_(DQ5B)/(DQ3B)/(DQ5B)) ; port Ch10_GainCtrl0
Ch10_GainCtrl1: U13.AA8(IO,_DIFFIO_B17p,_(DQ5B)/(DQ3B)/(DQ5B)) ; port Ch10_GainCtrl1
Ch11_GainCtrl0: U13.V9(IO,_VREFB3N0) ; port Ch11_GainCtrl0
Ch11_GainCtrl1: U13.AB8(IO,_DIFFIO_B17n,_(DQ5B)/(DQ3B)/(DQ5B)) ; port Ch11_GainCtrl1
Ch12_GainCtrl0: U13.V10(IO,_(DQS3B/CQ3B#,DPCLK2)/(DQS3B/CQ3B#,DPCLK2)/(DQS3B/CQ3B#,DPCLK2)) ; port Ch12_GainCtrl0
Ch12_GainCtrl1: U13.AA9(IO,_DIFFIO_B18p,_(DQ5B)/(DQ3B)/(DQ5B)) ; port Ch12_GainCtrl1
Ch13_GainCtrl0: U13.W10(IO,_DIFFIO_B20p,_(DQ5B)/(DQ3B)/(DQ5B)) ; port Ch13_GainCtrl0
Ch13_GainCtrl1: U13.AB9(IO,_DIFFIO_B18n,_(DQS5B/CQ5B#,DPCLK3)/(DQS5B/CQ5B#,DPCLK3)/(DQS5B/CQ5B#,DPCLK3)) ; port Ch13_GainCtrl1
Ch14_GainCtrl0: U13.Y10(IO,_DIFFIO_B20n,_(DQ5B)/(DQ3B)/(DQ5B)) ; port Ch14_GainCtrl0
Ch14_GainCtrl1: U13.AA10(IO,_DIFFIO_B21p,_(DM4B)/(DM5B1/BWS#5B1)/(DM5B1/BWS#5B1)) ; port Ch14_GainCtrl1
Ch15_GainCtrl0: U13.V11(IO,_DIFFIO_B19n,_(DQ5B)/(DQ3B)/(DQ5B)) ; port Ch15_GainCtrl0
Ch15_GainCtrl1: U13.AB10(IO,_DIFFIO_B21n,__/(DQ5B)/(DQ5B)) ; port Ch15_GainCtrl1
Ch16_GainCtrl0: U13.F10(IO,_DIFFIO_T10p,_(DATA6),_(DQ3T)/(DQ3T)/(DQ5T)) ; port Ch16_GainCtrl0
Ch16_GainCtrl1: U13.A10(IO,_DIFFIO_T21n,_(DQ5T)/(DQ3T)/(DQ5T)) ; port Ch16_GainCtrl1
Ch17_GainCtrl0: U13.E10(IO,_DIFFIO_T22p) ; port Ch17_GainCtrl0
Ch17_GainCtrl1: U13.B10(IO,_DIFFIO_T21p,_(PADD15)) ; port Ch17_GainCtrl1
Ch18_GainCtrl0: U13.D10(IO,_DIFFIO_T22n,_(DQ5T)/(DQ3T)/(DQ5T)) ; port Ch18_GainCtrl0
Ch18_GainCtrl1: U13.A9(IO,_DIFFIO_T20n,_(PADD16),_(DQ5T)/(DQ3T)/(DQ5T)) ; port Ch18_GainCtrl1
Ch19_GainCtrl0: U13.F9(IO) ; port Ch19_GainCtrl0
Ch19_GainCtrl1: U13.E9(IO) ; port Ch19_GainCtrl1
Ch20_GainCtrl0: U13.C10(IO,_VREFB8N0) ; port Ch20_GainCtrl0
Ch20_GainCtrl1: U13.B9(IO,_DIFFIO_T20p,_(PADD17),_(DQS5T/CQ5T#,DPCLK10)/(DQS5T/CQ5T#,DPCLK10)/(DQS5T/CQ5T#,DPCLK10)) ; port Ch20_GainCtrl1
Ch21_GainCtrl0: U13.F8(IO,_DIFFIO_T7n,_(DATA9),_(DQ3T)/(DQ3T)/(DQ5T)) ; port Ch21_GainCtrl0
Ch21_GainCtrl1: U13.E8(IO,_DIFFIO_T12p) ; port Ch21_GainCtrl1
Ch22_GainCtrl0: U13.D8(IO,_DIFFIO_T12n) ; port Ch22_GainCtrl0
Ch22_GainCtrl1: U13.A8(IO,_DIFFIO_T17n,_(DATA2),_(DQ5T)/(DQ3T)/(DQ5T)) ; port Ch22_GainCtrl1
Ch23_GainCtrl0: U13.C8(IO,_DIFFIO_T13n,_(DATA14),_(DQS3T/CQ3T#,DPCLK11)/(DQS3T/CQ3T#,DPCLK11)/(DQS3T/CQ3T#,DPCLK11)) ; port Ch23_GainCtrl0
Ch23_GainCtrl1: U13.B8(IO,_DIFFIO_T17p,_(DATA3),_(DQ5T)/(DQ3T)/(DQ5T)) ; port Ch23_GainCtrl1
Ch24_GainCtrl0: U13.D7(IO,_DIFFIO_T9p) ; port Ch24_GainCtrl0
Ch24_GainCtrl1: U13.E7(IO,_DIFFIO_T4p) ; port Ch24_GainCtrl1
Ch25_GainCtrl0: U13.F7(IO,_DIFFIO_T2n,_(DM3T/BWS#3T)/(DM3T1/BWS#3T1)/(DM5T3/BWS#5T3)) ; port Ch25_GainCtrl0
Ch25_GainCtrl1: U13.C7(IO,_DIFFIO_T13p,_(DATA13),_(DM5T/BWS#5T)/(DM3T0/BWS#3T0)/(DM5T2/BWS#5T2)) ; port Ch25_GainCtrl1
Ch26_GainCtrl0: U13.A7(IO,_DIFFIO_T16n,_(PADD18),_(DQ5T)/(DQ3T)/(DQ5T)) ; port Ch26_GainCtrl0
Ch26_GainCtrl1: U13.D6(IO,_DIFFIO_T4n) ; port Ch26_GainCtrl1
Ch27_GainCtrl0: U13.E6(IO,_PLL3_CLKOUTn) ; port Ch27_GainCtrl0
Ch27_GainCtrl1: U13.B7(IO,_DIFFIO_T16p,_(DATA4),_(DQ5T)/(DQ3T)/(DQ5T)) ; port Ch27_GainCtrl1
Ch28_GainCtrl0: U13.C6(IO,_DIFFIO_T9n,_(DATA7),_(DQ3T)/(DQ3T)/(DQ5T)) ; port Ch28_GainCtrl0
Ch28_GainCtrl1: U13.A6(IO,_DIFFIO_T15n,_(PADD19),_(DQ5T)/(DQ3T)/(DQ5T)) ; port Ch28_GainCtrl1
Ch29_GainCtrl0: U13.B6(IO,_DIFFIO_T15p,_(DATA15),_(DQ5T)/(DQ3T)/(DQ5T)) ; port Ch29_GainCtrl0
Ch29_GainCtrl1: U13.E5(IO,_PLL3_CLKOUTp) ; port Ch29_GainCtrl1
Ch30_GainCtrl0: U13.C4(IO,_DIFFIO_T3p,_(DATA12),_(DQS1T/CQ1T#,CDPCLK7)/(DQS1T/CQ1T#,CDPCLK7)/(DQS1T/CQ1T#,CDPCLK7)) ; port Ch30_GainCtrl0
Ch30_GainCtrl1: U13.A5(IO,_(DATA5),_(DQ3T)/(DQ3T)/(DQ5T)) ; port Ch30_GainCtrl1
Ch31_GainCtrl0: U13.B5(IO,_VREFB8N1) ; port Ch31_GainCtrl0
Ch31_GainCtrl1: U13.C3(IO,_DIFFIO_T3n,_(DQ3T)/(DQ3T)/(DQ5T)) ; port Ch31_GainCtrl1
ClkGen_LD: U13.G5(IO,_VREFB1N0) ; port ClkGen_LD
ClkGen_nCS: U13.J5(IO) ; port ClkGen_nCS
ClkGen_nPD: U13.H6(IO,_DIFFIO_L6p,_(DQ2L)/(DQ1L)/(DQ1L)) ; port ClkGen_nPD
ClkGen_nRESET: U13.J6(IO,_DIFFIO_L6n,_(DQ2L)/(DQ1L)/(DQ1L)) ; port ClkGen_nRESET
ClkGen_nSYNC: U13.H7(IO) ; port ClkGen_nSYNC
ClkGen_RefClock_n: U13.U20(IO,_DIFFIO_R34n,_(DQ3R)/(DQ3R)/(DQ1R)) ; port ClkGen_nRefClock
ClkGen_RefClock_p: U13.U19(IO,_DIFFIO_R34p) ; port ClkGen_RefClock
ClkGen_REFMON: U13.G3(IO,_DIFFIO_L1n) ; port ClkGen_REFMON
ClkGen_SCLK: U13.J1(IO,_DIFFIO_L15n,_(DQ0L)/(DQ1L)/(DQ1L)) ; port ClkGen_SCLK
ClkGen_SDIO: U13.J2(IO,_DIFFIO_L15p,_(DQ0L)/(DQ1L)/(DQ1L)) ; port ClkGen_SDIO
ClkGen_SDO: U13.J3(IO) ; port ClkGen_SDO
ClkGen_STATUS: U13.H5(IO,_VREFB1N1) ; port ClkGen_STATUS
Clock25MHz: U13.T1(CLK3,_DIFFCLK_1n) ; port Clock25MHz
Clock100MHz: U13.AA12(CLK13,_DIFFCLK_7p) ; port Clock100MHz
CONF_DONE: J4.3 R87.1 U13.M18(CONF_DONE)
DATA: C63.2 J4.7 U13.K1(IO,_(DATA0)) U14.2(DATA) VD3.1
DCLK: C66.2 J4.1 U13.K2(DCLK) U14.6(DCLK) VD4.1
EthAddrSelect1: U13.T11(IO,_DIFFIO_B13n)
EthAddrSelect2: U13.U11(IO,_DIFFIO_B19p)
EthAddrSelect3: U13.T10(IO,_DIFFIO_B13p)
EthAddrSelect4: U13.U10(IO,_(DQ5B)/(DQ3B)/(DQ5B))
EthAddrSelect5: U13.U9(IO,_DIFFIO_B8p,_(DQ3B)/(DQ3B)/(DQ5B))
EthAddrSelect6: U13.U8(IO,_DIFFIO_B2n)
EthAddrSelect7: U13.U7(IO,_DIFFIO_B2p)
EthAddrSelect8: U13.V5(IO,_DIFFIO_B1n,_(DM3B/BWS#3B)/(DM3B1/BWS#3B1)/(DM5B3/BWS#5B3))
EthClock25MHz: U13.E4(IO,_DIFFIO_L3p,_(nRESET),_(DQ2L)/(DQ1L)/(DQ1L)) ; port EthClock25MHz
EthCOL: U13.G4(IO,_DIFFIO_L1p) ; port COL
EthCRS: U13.E3(IO,_DIFFIO_L3n,_(DQ2L)/(DQ1L)/(DQ1L)) ; port CRS
EthRX_CLK: U13.J4(IO,_(DQS0L/CQ1L,DPCLK0)/(DQS0L/CQ1L,DPCLK0)/(DQS0L/CQ1L,DPCLK0)) ; port RX_CLK
EthRX_DV: U13.H3(IO,_DIFFIO_L7n) ; port RX_DV
EthRXD0: U13.F2(IO,_DIFFIO_L9p,_(DM2L)/(DM1L0/BWS#1L0)/(DM1L0/BWS#1L0))
EthRXD1: U13.F1(IO,_DIFFIO_L9n,_(DQ0L)/(DQ1L)/(DQ1L))
EthRXD2: U13.H2(IO,_DIFFIO_L13p,_(DQ0L)/(DQ1L)/(DQ1L))
EthRXD3: U13.H1(IO,_DIFFIO_L13n,_(DQ0L)/(DQ1L)/(DQ1L))
EthTX_CLK: U13.C2(IO,_DIFFIO_L4p,_(DQS2L/CQ3L,CDPCLK0)/(DQS2L/CQ3L,CDPCLK0)/(DQS2L/CQ3L,CDPCLK0)) ; port TX_CLK
EthTX_EN: U13.H4(IO,_DIFFIO_L7p) ; port TX_EN
EthTXD0: U13.E1(IO,_DIFFIO_L8n,__/(DQ1L)/(DQ1L))
EthTXD1: U13.D2(IO,_DIFFIO_L5p,_(DQ2L)/(DQ1L)/(DQ1L))
EthTXD2: U13.C1(IO,_DIFFIO_L4n,_(DQ2L)/(DQ1L)/(DQ1L))
EthTXD3: U13.B1(IO,_DIFFIO_L2n,_(DQ2L)/(DQ1L)/(DQ1L))
FRAM_A0: U13.M1(IO,_DIFFIO_L17n,__/(DQ1L)/(DQ1L))
FRAM_A1: U13.M2(IO,_DIFFIO_L17p,_(DQ0L)/(DQ1L)/(DQ1L))
FRAM_A2: U13.N1(IO,_DIFFIO_L19n,_(DQ1L)/(DQ3L)/(DQ1L))
FRAM_A3: U13.N2(IO,_DIFFIO_L19p,_(DQ1L)/(DQ3L)/(DQ1L))
FRAM_A4: U13.P1(IO,_DIFFIO_L20n,_(DQ1L)/(DQ3L)/(DQ1L))
FRAM_A5: U13.AA2(IO,_DIFFIO_L31p)
FRAM_A6: U13.AA1(IO,_DIFFIO_L31n,_(DQ3L)/(DQ3L)/(DQ1L))
FRAM_A7: U13.Y2(IO,_DIFFIO_L29p,_(DQ3L)/(DQ3L)/(DQ1L))
FRAM_A8: U13.W2(IO,_DIFFIO_L28p,_(DQ3L)/(DQ3L)/(DQ1L))
FRAM_A9: U13.W1(IO,_DIFFIO_L28n,_(DQ3L)/(DQ3L)/(DQ1L))
FRAM_A10: U13.V2(IO,_DIFFIO_L25p,_(DQ3L)/(DQ3L)/(DQ1L))
FRAM_A11: U13.V1(IO,_DIFFIO_L25n,_(DQ3L)/(DQ3L)/(DQ1L))
FRAM_A12: U13.U2(IO,_DIFFIO_L24p,_(DM1L/BWS#1L)/(DM3L0/BWS#3L0)/(DM1L2/BWS#1L2))
FRAM_A13: U13.U1(IO,_DIFFIO_L24n,_(DQ3L)/(DQ3L)/(DQ1L))
FRAM_A14: U13.R2(IO,_DIFFIO_L21p,_(DQ1L)/(DQ3L)/(DQ1L))
FRAM_A15: U13.R1(IO,_DIFFIO_L21n,_(DQ1L)/(DQ3L)/(DQ1L))
FRAM_A16: U13.P2(IO,_DIFFIO_L20p,_(DQ1L)/(DQ3L)/(DQ1L))
FRAM_D0: U13.M5(IO,_VREFB2N0)
FRAM_D1: U13.M3(IO,_DIFFIO_L18n,_(DQ1L)/(DQ3L)/(DQ1L))
FRAM_D2: U13.M6(IO,_DIFFIO_L16n,_(DQ0L)/(DQ1L)/(DQ1L))
FRAM_D3: U13.M4(IO,_DIFFIO_L18p,_(DM0L)/(DM1L1/BWS#1L1)/(DM1L1/BWS#1L1))
FRAM_D4: U13.N6(IO,_DIFFIO_L26n,_(DQ3L)/(DQ3L)/(DQ1L))
FRAM_D5: U13.N5(IO,_(DQ1L)/(DQ3L)/(DQ1L))
FRAM_D6: U13.P3(IO,_DIFFIO_L23n,_(DQ1L)/(DQ3L)/(DQ1L))
FRAM_D7: U13.P5(IO,_DIFFIO_L26p)
FRAM_D8: U13.P4(IO,_DIFFIO_L23p,_(DQS1L/CQ1L#,DPCLK1)/(DQS1L/CQ1L#,DPCLK1)/(DQS1L/CQ1L#,DPCLK1))
FRAM_D9: U13.R3(IO,_DIFFIO_L27n)
FRAM_D10: U13.R5(IO,_DIFFIO_L32n)
FRAM_D11: U13.R4(IO,_DIFFIO_L27p)
FRAM_D12: U13.T5(IO,_DIFFIO_L33p,_(DM3L/BWS#3L)/(DM3L1/BWS#3L1)/(DM1L3/BWS#1L3))
FRAM_D13: U13.T4(IO,_(DQS3L/CQ3L#,CDPCLK1)/(DQS3L/CQ3L#,CDPCLK1)/(DQS3L/CQ3L#,CDPCLK1))
FRAM_D14: U13.V3(IO,_RDN1)
FRAM_D15: U13.V4(IO,_RUP1)
FRAM_nCE: U13.P6(IO,_DIFFIO_L32p) ; port FRAM_nCE
FRAM_nOE: U13.Y1(IO,_DIFFIO_L29n,_(DQ3L)/(DQ3L)/(DQ1L)) ; port FRAM_nOE
FRAM_nWE: U13.P7(IO,_DIFFIO_L30n) ; port FRAM_nWE
FRAM_nZZ: U13.T3(IO,_VREFB2N1) ; port FRAM_nZZ
Hit_n: U13.F17(IO,_DIFFIO_R1n,_(DQ2R)/(DQ1R)/(DQ1R)) ; port Hit_n
Hit_p: U13.G17(IO,_DIFFIO_R1p) ; port Hit_p
IdRead: U13.G11(IO) ; port IdRead
nCE: J4.6 R89.1 U13.L3(nCE)
nClock100MHz: U13.AB12(CLK12,_DIFFCLK_7n) ; port nClock100MHz
nCONFIG: J4.5 R88.1 U13.K5(nCONFIG)
nCSO: C67.2 J4.8 U13.E2(IO,_DIFFIO_L8p,_(FLASH_nCE,_nCSO)) U14.1(nCS) VD3.2
nLed0: U13.N7(IO,_DIFFIO_L30p) ; port nLed0
nLed1: U13.L6(IO,_DIFFIO_L16p,_(DQ0L)/(DQ1L)/(DQ1L)) ; port nLed1
nSTATUS: R90.1 U13.K6(nSTATUS)
nVoltageCS: U13.A4(IO,_DIFFIO_T8n,_(DQ3T)/(DQ3T)/(DQ5T)) ; port nVoltageCS
Reserved_n: R92.1 U13.G14(IO,_DIFFIO_T32n) ; port Reserved_n
Reserved_p: R92.2 U13.G13(IO,_DIFFIO_T32p) ; port Reserved_p
Strobe_n: R91.1 U13.E11(IO,_DIFFIO_T23n,_(PADD13)) ; port Strobe_n
Strobe_p: R91.2 U13.F11(IO,_DIFFIO_T23p,_(PADD14),_(DM4T)/(DM5T1/BWS#5T1)/(DM5T1/BWS#5T1)) ; port Strobe_p
TCK: J5.1 R93.1 U13.L2(TCK)
TDI: J5.9 R95.1 U13.L5(TDI)
TDO: J5.3 U13.L4(TDO)
ThermoSCL: U13.J7(IO,_DIFFIO_L11p) ; port ThermoSCL
ThermoSDA: U13.K7(IO,_DIFFIO_L11n) ; port ThermoSDA
Tmp0: U13.T16(IO,_PLL4_CLKOUTp)
Tmp1: U13.R16(IO,_PLL4_CLKOUTn)
Tmp2: U13.R15(IO,_DIFFIO_B41n)
Tmp3: U13.R18(IO,_DIFFIO_R26n)
Tmp4: U13.R19(IO,_DIFFIO_R26p,_(DM1R/BWS#1R)/(DM3R0/BWS#3R0)/(DM1R2/BWS#1R2))
Tmp5: U13.J20(IO,_DIFFIO_R10n)
Tmp6: U13.F21(IO,_DIFFIO_R11p,_(DQ0R)/(DQ1R)/(DQ1R))
Tmp7: U13.F22(IO,_DIFFIO_R11n,_(DQ0R)/(DQ1R)/(DQ1R))
Tmp8: U13.F16(IO,_DIFFIO_T42n)
Tmp9: U13.E16(IO,_DIFFIO_T42p,_(DQ2T)/(DQ5T)/(DQ5T))
Tmp10: U13.G15(IO,_DIFFIO_T40n)
Tmp11: U13.F15(IO,_DIFFIO_T41n,_(DQ2T)/(DQ5T)/(DQ5T))
Tmp12: U13.F14(IO,_DIFFIO_T40p,_(DQS0T/CQ1T,CDPCLK6)/(DQS0T/CQ1T,CDPCLK6)/(DQS0T/CQ1T,CDPCLK6))
Tmp13: U13.G10(IO,_DIFFIO_T10n)
Tmp14: U13.G9(IO)
Tmp15: U13.G8(IO,_DIFFIO_T7p)
TMS: J5.5 R94.1 U13.L1(TMS)
VoltageDin: U13.B3(IO,_DIFFIO_T5p,_(DATA11),_(DQ3T)/(DQ3T)/(DQ5T)) ; port VoltageDin
VoltageDout: U13.A3(IO,_DIFFIO_T5n,_(DATA10),_(DQ3T)/(DQ3T)/(DQ5T)) ; port VoltageDout
VoltageSclk: U13.B4(IO,_DIFFIO_T8p,_(DATA8),_(DQ3T)/(DQ3T)/(DQ5T)) ; port VoltageSclk
NetC91_2: C91.2 L8.2 U13.G6(VCCA3)
NetC92_2: C92.2 L7.2 U13.E17(VCCD_PLL2)
NetC93_2: C93.2 L9.2 U13.F6(VCCD_PLL3)
NetC94_2: C94.2 L6.2 U13.F18(VCCA2)
NetC95_2: C95.2 L10.2 U13.U18(VCCA4)
NetC96_2: C96.2 L5.2 U13.U6(VCCD_PLL1)
NetC97_2: C97.2 L11.2 U13.V17(VCCD_PLL4)
NetC98_2: C98.2 L4.2 U13.T6(VCCA1)

Not connected (* = marked no-connect by the designer): J5 6 7 8

### Buses and harness runs
bus EthAddrSelect[8..1] = port EthAddrSelect[8..1]
bus EthRXD[3..0] = port RXD[3..0]
bus EthTXD[3..0] = port TXD[3..0]
bus FRAM_A[16..0] = port FRAM_A[16..0]
bus FRAM_D[15..0] = port FRAM_D[15..0]

### Notes on the sheet
- (near U13) Bank1
- (near U13) Bank2
- (near U13) Bank5
- (near U13) Bank6
- (near U13) Bank7
- (near U13) Bank8
- (near U13) Bank3
- (near U13) Bank4
- 3.3 V power signals
- Test points
- 2.5 V power signals
- LVDS to bus connector
- Модуль регистрации - FPGA
- (in symbol EP3C55F484C7, part A) BANK 1
- (in symbol EP3C55F484C7, part B) BANK 2
- (in symbol EP3C55F484C7, part C) BANK 3
- (in symbol EP3C55F484C7, part D) BANK 4
- (in symbol EP3C55F484C7, part E) BANK 5
- (in symbol EP3C55F484C7, part F) BANK 6
- (in symbol EP3C55F484C7, part G) BANK 7
- (in symbol EP3C55F484C7, part H) BANK 8

### Library data of the parts
C13-C16 C18-C20 C22 C48-C99 C252-C271 = C
L4-L11 = INDUCTOR
R79-R86 R91 R92 = r
R87-R90 R93-R95 = R
U13 = EP3C55F484C7: Cyclone III Family FPGA, 327 I/O Pins, 4 PLLs, 484-Pin FBGA, Speed Grade 7, Commercial Grade; Published: 26-Feb-2007; DatasheetVersion: ver2.0, May-2008; PackageVersion: ver15.1, May-2008; PackageReference: FBGA484-3; Publisher: Altium Limited; PackageDescription: 484-Ball FineLine Ball Grid Array (FBGA484) - Option 3 - Wire Bond; Code_JEDEC: MS-034-AAJ-1; ComponentLink1Description: Manufacturer Link; ComponentLink1URL: http://www.altera.com/; ComponentLink2Description: Handbook (7.86MB); ComponentLink2URL: http://www.altera.com/literature/hb/cyc3/cyclone3_handbook.pdf; ComponentLink3Description: Packaging Specification; ComponentLink3URL: http://www.altera.com/literature/ds/dspkg.pdf
U14 = EPCS1: Serial configuration device for Cyclone (Altera)
VD3 VD4 = BAT54C: Double schottky barrier diodes with common cathode

## Sheet Ethernet.SchDoc
size A4; PageSetup: Record=PageOptions|CenterHorizontal=True|CenterVertical=True|PrintScale=0.96|XCorrection=1.00|YCorrection=1.00|PrintKind=2|BorderSize=5000000|LeftOffset=0|BottomOffset=0|Orientation=2|PaperLength=1000|PaperWidth=1000|Scale=100|PaperSource=7|PrintQuality=-4|MediaType=1|DitherType=10|PaperKind=A4|PrintScaleMode=1
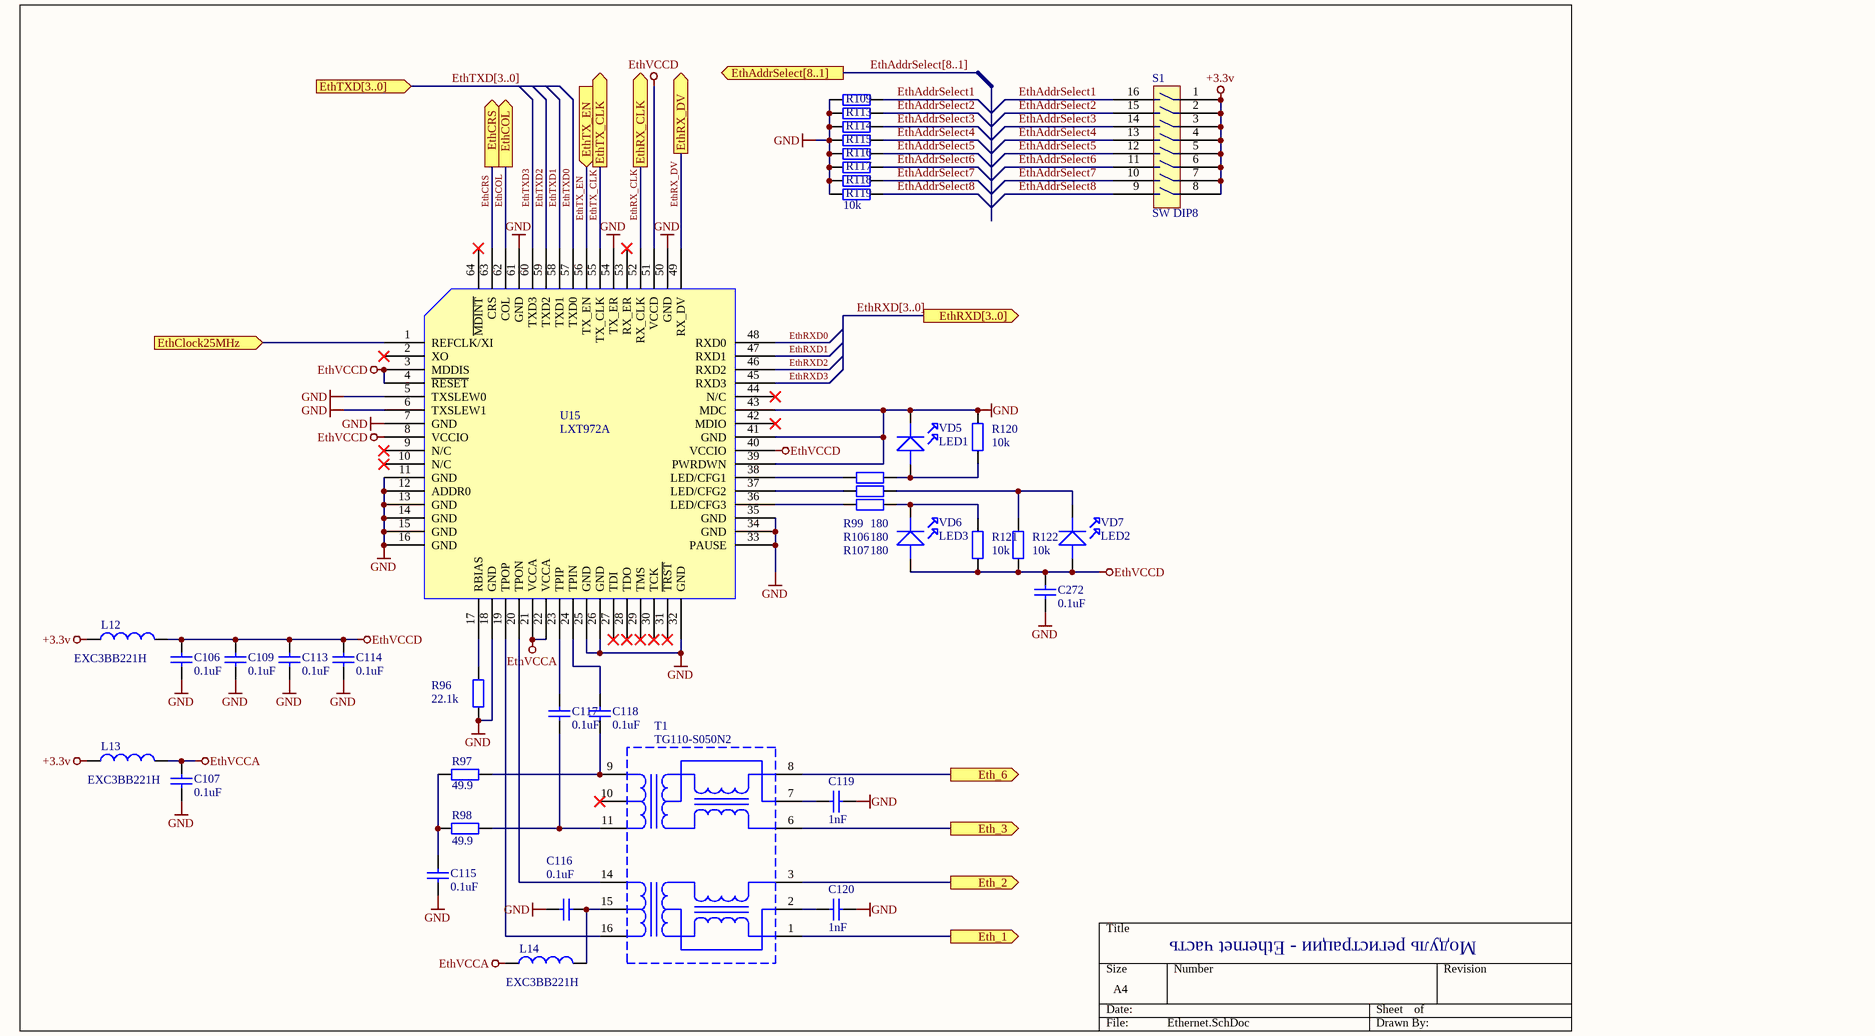
[diagram p9: Ethernet.SchDoc]

### Parts
C106  0.1uF  [0603]
C107  0.1uF  [0603]
C109  0.1uF  [0603]
C113  0.1uF  [0603]
C114  0.1uF  [0603]
C115  0.1uF  [0603]
C116  0.1uF  [0603]
C117  0.1uF  [0603]
C118  0.1uF  [0603]
C119  1nF  [0603]
C120  1nF  [0603]
C272  0.1uF  [0603]
L12  EXC3BB221H  [0603]
L13  EXC3BB221H  [0603]
L14  EXC3BB221H  [0603]
R96  22.1k  [0805]
R97  49.9  [0805]
R98  49.9  [0805]
R99  180  [0805]
R106  180  [0805]
R107  180  [0805]
R109  10k  [0603]  (value not drawn)
R113  10k  [0603]  (value not drawn)
R114  10k  [0603]  (value not drawn)
R115  10k  [0603]  (value not drawn)
R116  10k  [0603]  (value not drawn)
R117  10k  [0603]  (value not drawn)
R118  10k  [0603]  (value not drawn)
R119  10k  [0603]
R120  10k  [0603]
R121  10k  [0603]
R122  10k  [0603]
S1  SW DIP8  [SWD4-8]
T1  TG110-S050N2  [SO-G16/G6.9]
U15  LXT972A  [TQFP64]
VD5  LED1  [LED1206]
VD6  LED3  [LED1206]
VD7  LED2  [LED1206]

### Ports
Eth_1 (out), Eth_2 (out), Eth_3 (out), Eth_6 (out), EthAddrSelect[8..1] (out), EthClock25MHz (in), EthCOL (out), EthCRS (out), EthRX_CLK (out), EthRX_DV (out), EthRXD[3..0] (out), EthTX_CLK (out), EthTX_EN (in), EthTXD[3..0] (in)

### Nets
+3.3v: L12.1 L13.1 S1.1 S1.2 S1.3 S1.4 S1.5 S1.6 S1.7 S1.8
EthVCCA: C107.2 L13.2 L14.1 U15.21(VCCA) U15.22(VCCA)
EthVCCD: C106.2 C109.2 C113.2 C114.2 C272.2 L12.2 R121.1 R122.1 U15.3(MDDIS) U15.4(~{RESET}) U15.8(VCCIO) U15.40(VCCIO) U15.51(VCCD) VD6.ANODE VD7.ANODE
GND: C106.1 C107.1 C109.1 C113.1 C114.1 C115.2 C116.1 C119.2 C120.1 C272.1 R96.2 R109.2 R113.2 R114.2 R115.2 R116.2 R117.2 R118.2 R119.2 R120.2 U15.5(TXSLEW0) U15.6(TXSLEW1) U15.7(GND) U15.11(GND) U15.12(ADDR0) U15.13(GND) U15.14(GND) U15.15(GND) U15.16(GND) U15.18(GND) U15.25(GND) U15.26(GND) U15.32(GND) U15.33(PAUSE) U15.34(GND) U15.35(GND) U15.39(PWRDWN) U15.41(GND) U15.43(MDC) U15.50(GND) U15.54(TX_ER) U15.61(GND) VD5.CATHODE  [project net C_L1-PhD1]
Eth_1: T1.1 ; port Eth_1
Eth_2: T1.3 ; port Eth_2
Eth_3: T1.6 ; port Eth_3
Eth_6: T1.8 ; port Eth_6
EthAddrSelect1: R109.1 S1.16
EthAddrSelect2: R113.1 S1.15
EthAddrSelect3: R114.1 S1.14
EthAddrSelect4: R115.1 S1.13
EthAddrSelect5: R116.1 S1.12
EthAddrSelect6: R117.1 S1.11
EthAddrSelect7: R118.1 S1.10
EthAddrSelect8: R119.1 S1.9
EthClock25MHz: U15.1(REFCLK/XI) ; port EthClock25MHz
EthCOL: U15.62(COL) ; port EthCOL
EthCRS: U15.63(CRS) ; port EthCRS
EthRX_CLK: U15.52(RX_CLK) ; port EthRX_CLK
EthRX_DV: U15.49(RX_DV) ; port EthRX_DV
EthRXD0: U15.48(RXD0)
EthRXD1: U15.47(RXD1)
EthRXD2: U15.46(RXD2)
EthRXD3: U15.45(RXD3)
EthTX_CLK: U15.55(TX_CLK) ; port EthTX_CLK
EthTX_EN: U15.56(TX_EN) ; port EthTX_EN
EthTXD0: U15.57(TXD0)
EthTXD1: U15.58(TXD1)
EthTXD2: U15.59(TXD2)
EthTXD3: U15.60(TXD3)
NetC115_1: C115.1 R97.1 R98.2
NetC116_2: C116.2 L14.2 T1.15
NetC117_1: C117.1 R98.1 T1.11
NetC117_2: C117.2 U15.23(TPIP)
NetC118_1: C118.1 R97.2 T1.9
NetC118_2: C118.2 U15.24(TPIN)
NetC119_1: C119.1 T1.7
NetC120_2: C120.2 T1.2
NetR96_1: R96.1 U15.17(RBIAS)
NetR99_1: R99.1 U15.38(LED/CFG1)
NetR99_2: R99.2 R120.1 VD5.ANODE
NetR106_1: R106.1 U15.37(LED/CFG2)
NetR106_2: R106.2 R122.2 VD7.CATHODE
NetR107_1: R107.1 U15.36(LED/CFG3)
NetR107_2: R107.2 R121.2 VD6.CATHODE
NetT1_14: T1.14 U15.20(TPON)
NetT1_16: T1.16 U15.19(TPOP)

Not connected (* = marked no-connect by the designer): T1 10*; U15 2(XO)* 9(N/C)* 10(N/C)* 27(TDI)* 28(TDO)* 29(TMS)* 30(TCK)* 31(~{TRST})* 42(MDIO)* 44(N/C)* 53(RX_ER)* 64(~{MDINT})*

### Buses and harness runs
bus EthAddrSelect[8..1] = port EthAddrSelect[8..1]
bus EthRXD[3..0] = port EthRXD[3..0]
bus EthTXD[3..0] = port EthTXD[3..0]

### Notes on the sheet
- Модуль регистрации - Ethernet часть

### Library data of the parts
C106 C107 C109 C113-C120 C272 = Cap: Capacitor; Published: 8-Jun-2000; LatestRevisionDate: 17-Jul-2002; LatestRevisionNote: Re-released for DXP Platform.; Publisher: Altium Limited
  C106 C107 C109 C113-C118 C272: Value: 0.1uF
  C119 C120: Value: 1nF
L12-L14 = INDUCTOR
R96-R99 R106 R107 R109 R113-R122 = Res2: Resistor; Published: 8-Jun-2000; LatestRevisionDate: 17-Jul-2002; LatestRevisionNote: Re-released for DXP Platform.; Publisher: Altium Limited; PackageReference: AXIAL-0.4
  R96: Value: 22.1k
  R97 R98: Value: 49.9
  R99 R106 R107: Value: 180
  R109 R113-R122: Value: 10k
VD6 VD7 = LED1

## Sheet TopAmplifier.SchDoc
size 215 x 228 mm; PageSetup: Record=PageOptions|CenterHorizontal=True|CenterVertical=True|PrintScale=0.97|XCorrection=1.00|YCorrection=1.00|PrintKind=1|BorderSize=5000000|LeftOffset=0|BottomOffset=0|Orientation=2|PaperLength=1270|PaperWidth=1000|Scale=100|PaperSource=4|PrintQuality=600|MediaType=1|DitherType=10|PaperKind=A4|PrintScaleMode=1
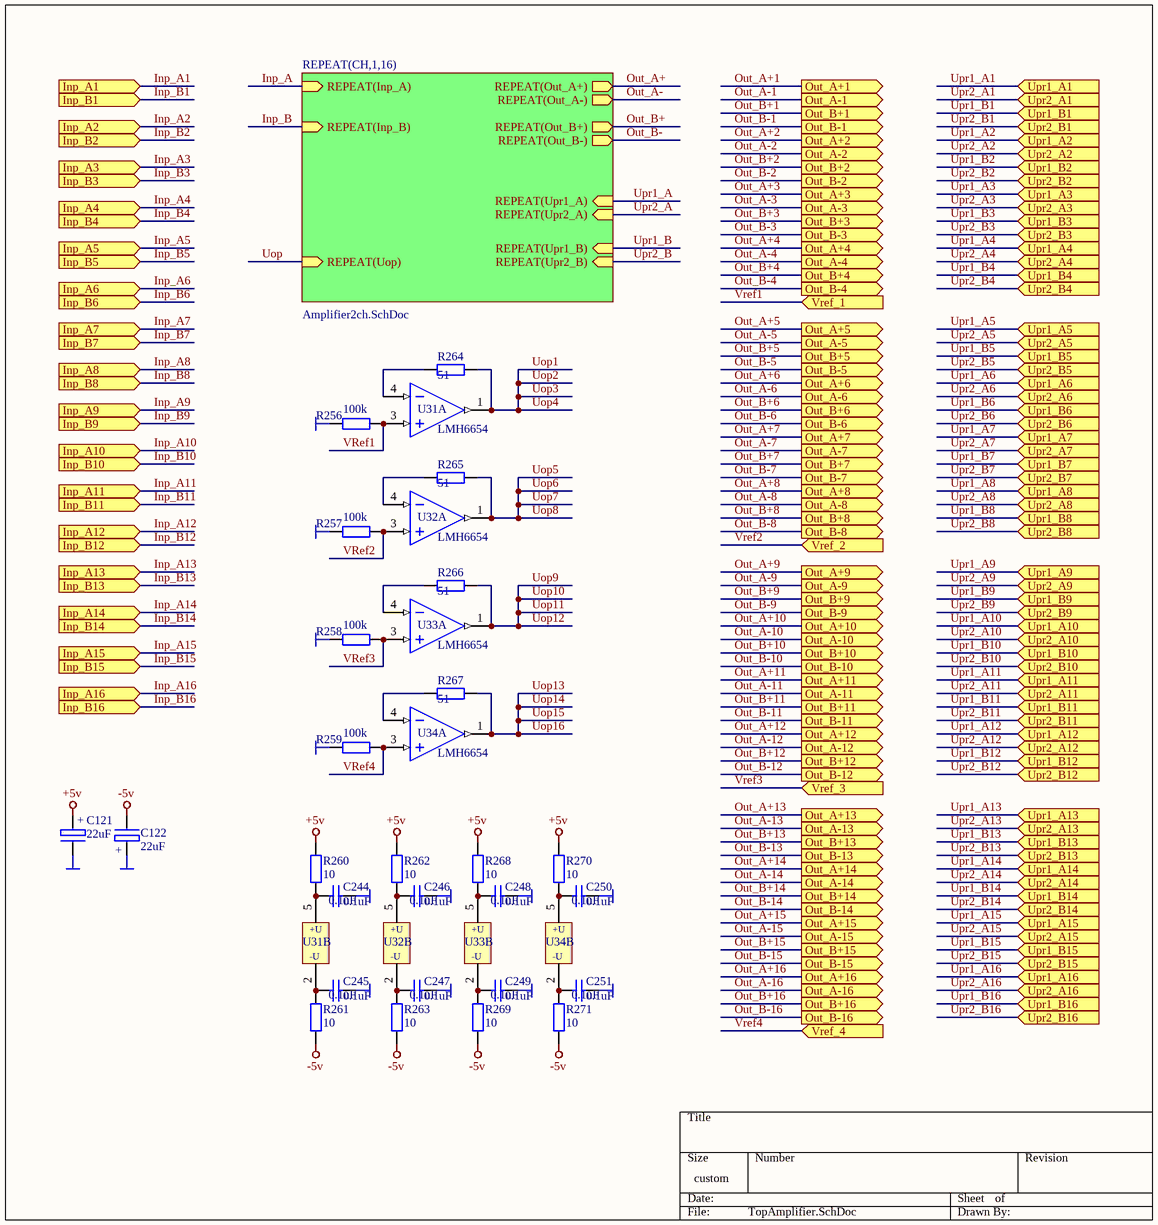
[diagram p10: TopAmplifier.SchDoc]

### Parts
C121  22uF  [CP6032]
C122  22uF  [CP6032]
C244  0.1uF  [0402]
C245  0.1uF  [0402]
C246  0.1uF  [0402]
C247  0.1uF  [0402]
C248  0.1uF  [0402]
C249  0.1uF  [0402]
C250  0.1uF  [0402]
C251  0.1uF  [0402]
R256  100k  [0603]
R257  100k  [0603]
R258  100k  [0603]
R259  100k  [0603]
R260  10  [0603]
R261  10  [0603]
R262  10  [0603]
R263  10  [0603]
R264  51  [0603]
R265  51  [0603]
R266  51  [0603]
R267  51  [0603]
R268  10  [0603]
R269  10  [0603]
R270  10  [0603]
R271  10  [0603]
U31  LMH6654  [SOT-23-5]  (parts A,B of 2)
U32  LMH6654  [SOT-23-5]  (parts A,B of 2)
U33  LMH6654  [SOT-23-5]  (parts A,B of 2)
U34  LMH6654  [SOT-23-5]  (parts A,B of 2)

### Sub-sheets
REPEAT(CH,1,16) = Amplifier2ch.SchDoc: REPEAT(Inp_A) (in), REPEAT(Out_A-) (out), REPEAT(Out_A+) (out), REPEAT(Out_B-) (out), REPEAT(Out_B+) (out), REPEAT(Inp_B) (in), REPEAT(Uop) (in), REPEAT(Upr1_A) (in), REPEAT(Upr2_A) (in), REPEAT(Upr1_B) (in), REPEAT(Upr2_B) (in)

### Ports
Inp_A1 (in), Inp_A2 (in), Inp_A3 (in), Inp_A4 (in), Inp_A5 (in), Inp_A6 (in), Inp_A7 (in), Inp_A8 (in), Inp_A9 (in), Inp_A10 (in), Inp_A11 (in), Inp_A12 (in), Inp_A13 (in), Inp_A14 (in), Inp_A15 (in), Inp_A16 (in), Inp_B1 (in), Inp_B2 (in), Inp_B3 (in), Inp_B4 (in), Inp_B5 (in), Inp_B6 (in), Inp_B7 (in), Inp_B8 (in), Inp_B9 (in), Inp_B10 (in), Inp_B11 (in), Inp_B12 (in), Inp_B13 (in), Inp_B14 (in), Inp_B15 (in), Inp_B16 (in), Out_A+1 (out), Out_A+2 (out), Out_A+3 (out), Out_A+4 (out), Out_A+5 (out), Out_A+6 (out), Out_A+7 (out), Out_A+8 (out), Out_A+9 (out), Out_A+10 (out), Out_A+11 (out), Out_A+12 (out), Out_A+13 (out), Out_A+14 (out), Out_A+15 (out), Out_A+16 (out), Out_A-1 (out), Out_A-2 (out), Out_A-3 (out), Out_A-4 (out), Out_A-5 (out), Out_A-6 (out), Out_A-7 (out), Out_A-8 (out), Out_A-9 (out), Out_A-10 (out), Out_A-11 (out), Out_A-12 (out), Out_A-13 (out), Out_A-14 (out), Out_A-15 (out), Out_A-16 (out), Out_B+1 (out), Out_B+2 (out), Out_B+3 (out), Out_B+4 (out), Out_B+5 (out), Out_B+6 (out), Out_B+7 (out), Out_B+8 (out), Out_B+9 (out), Out_B+10 (out), Out_B+11 (out), Out_B+12 (out), Out_B+13 (out), Out_B+14 (out), Out_B+15 (out), Out_B+16 (out), Out_B-1 (out), Out_B-2 (out), Out_B-3 (out), Out_B-4 (out), Out_B-5 (out), Out_B-6 (out), Out_B-7 (out), Out_B-8 (out), Out_B-9 (out), Out_B-10 (out), Out_B-11 (out), Out_B-12 (out), Out_B-13 (out), Out_B-14 (out), Out_B-15 (out), Out_B-16 (out), Upr1_A1 (in), Upr1_A2 (in), Upr1_A3 (in), Upr1_A4 (in), Upr1_A5 (in), Upr1_A6 (in), Upr1_A7 (in), Upr1_A8 (in), Upr1_A9 (in), Upr1_A10 (in), Upr1_A11 (in), Upr1_A12 (in), Upr1_A13 (in), Upr1_A14 (in), Upr1_A15 (in), Upr1_A16 (in), Upr1_B1 (in), Upr1_B2 (in), Upr1_B3 (in), Upr1_B4 (in), Upr1_B5 (in), Upr1_B6 (in), Upr1_B7 (in), Upr1_B8 (in), Upr1_B9 (in), Upr1_B10 (in), Upr1_B11 (in), Upr1_B12 (in), Upr1_B13 (in), Upr1_B14 (in), Upr1_B15 (in), Upr1_B16 (in), Upr2_A1 (in), Upr2_A2 (in), Upr2_A3 (in), Upr2_A4 (in), Upr2_A5 (in), Upr2_A6 (in), Upr2_A7 (in), Upr2_A8 (in), Upr2_A9 (in), Upr2_A10 (in), Upr2_A11 (in), Upr2_A12 (in), Upr2_A13 (in), Upr2_A14 (in), Upr2_A15 (in), Upr2_A16 (in), Upr2_B1 (in), Upr2_B2 (in), Upr2_B3 (in), Upr2_B4 (in), Upr2_B5 (in), Upr2_B6 (in), Upr2_B7 (in), Upr2_B8 (in), Upr2_B9 (in), Upr2_B10 (in), Upr2_B11 (in), Upr2_B12 (in), Upr2_B13 (in), Upr2_B14 (in), Upr2_B15 (in), Upr2_B16 (in), Vref_1 (in), Vref_2 (in), Vref_3 (in), Vref_4 (in)

### Nets
+5v: C121.+ R260.2 R262.2 R268.2 R270.2
-5v: C122.- R261.1 R263.1 R269.1 R271.1
AGND: C121.- C122.+ C244.1 C245.1 C246.1 C247.1 C248.1 C249.1 C250.1 C251.1 R256.1 R257.1 R258.1 R259.1  [also labelled GND]  [project net C_L1-PhD1]
Inp_A: sheet REPEAT(CH,1,16)/REPEAT(Inp_A)
Inp_B: sheet REPEAT(CH,1,16)/REPEAT(Inp_B)
Out_A+: sheet REPEAT(CH,1,16)/REPEAT(Out_A+)
Out_A-: sheet REPEAT(CH,1,16)/REPEAT(Out_A-)
Out_B+: sheet REPEAT(CH,1,16)/REPEAT(Out_B+)
Out_B-: sheet REPEAT(CH,1,16)/REPEAT(Out_B-)
Uop: sheet REPEAT(CH,1,16)/REPEAT(Uop)
Uop1: R264.2 U31.1(OUT)  [also labelled Uop2, Uop3, Uop4]
Uop5: R265.2 U32.1(OUT)  [also labelled Uop6, Uop7, Uop8]
Uop10: R266.2 U33.1(OUT)  [also labelled Uop11, Uop12, Uop9]
Uop13: R267.2 U34.1(OUT)  [also labelled Uop14, Uop15, Uop16]
Upr1_A: sheet REPEAT(CH,1,16)/REPEAT(Upr1_A)
Upr1_B: sheet REPEAT(CH,1,16)/REPEAT(Upr1_B)
Upr2_A: sheet REPEAT(CH,1,16)/REPEAT(Upr2_A)
Upr2_B: sheet REPEAT(CH,1,16)/REPEAT(Upr2_B)
Vref1: R256.2 U31.3(IN+) ; port Vref_1  [project net Adc0_Vref]
Vref2: R257.2 U32.3(IN+) ; port Vref_2  [project net Adc1_Vref]
Vref3: R258.2 U33.3(IN+) ; port Vref_3  [project net Adc2_Vref]
Vref4: R259.2 U34.3(IN+) ; port Vref_4  [project net Adc3_Vref]
NetC244_2: C244.2 R260.1 U31.5(VDD)
NetC245_2: C245.2 R261.2 U31.2(GND)
NetC246_2: C246.2 R262.1 U32.5(VDD)
NetC247_2: C247.2 R263.2 U32.2(GND)
NetC248_2: C248.2 R268.1 U33.5(VDD)
NetC249_2: C249.2 R269.2 U33.2(GND)
NetC250_2: C250.2 R270.1 U34.5(VDD)
NetC251_2: C251.2 R271.2 U34.2(GND)
NetR264_1: R264.1 U31.4(IN-)
NetR265_1: R265.1 U32.4(IN-)
NetR266_1: R266.1 U33.4(IN-)
NetR267_1: R267.1 U34.4(IN-)

### Notes on the sheet
- (in symbol LMH6654, part B) +U; -U

### Library data of the parts
C121 C122 = C POL
C244-C251 = Cap: Capacitor; Published: 8-Jun-2000; LatestRevisionDate: 17-Jul-2002; LatestRevisionNote: Re-released for DXP Platform.; PackageReference: RAD-0.3; Publisher: Altium Limited; Value: 0.1uF
R256-R271 = Res2: Resistor; Published: 8-Jun-2000; LatestRevisionDate: 17-Jul-2002; LatestRevisionNote: Re-released for DXP Platform.; PackageReference: AXIAL-0.4; Publisher: Altium Limited
  R256-R259: Value: 100k
  R260-R263 R268-R271: Value: 10
  R264-R267: Value: 51
U31-U34 = LMH6654: Value: LMH6654